# EAGLE design ssl (EAGLE 6.5.0)
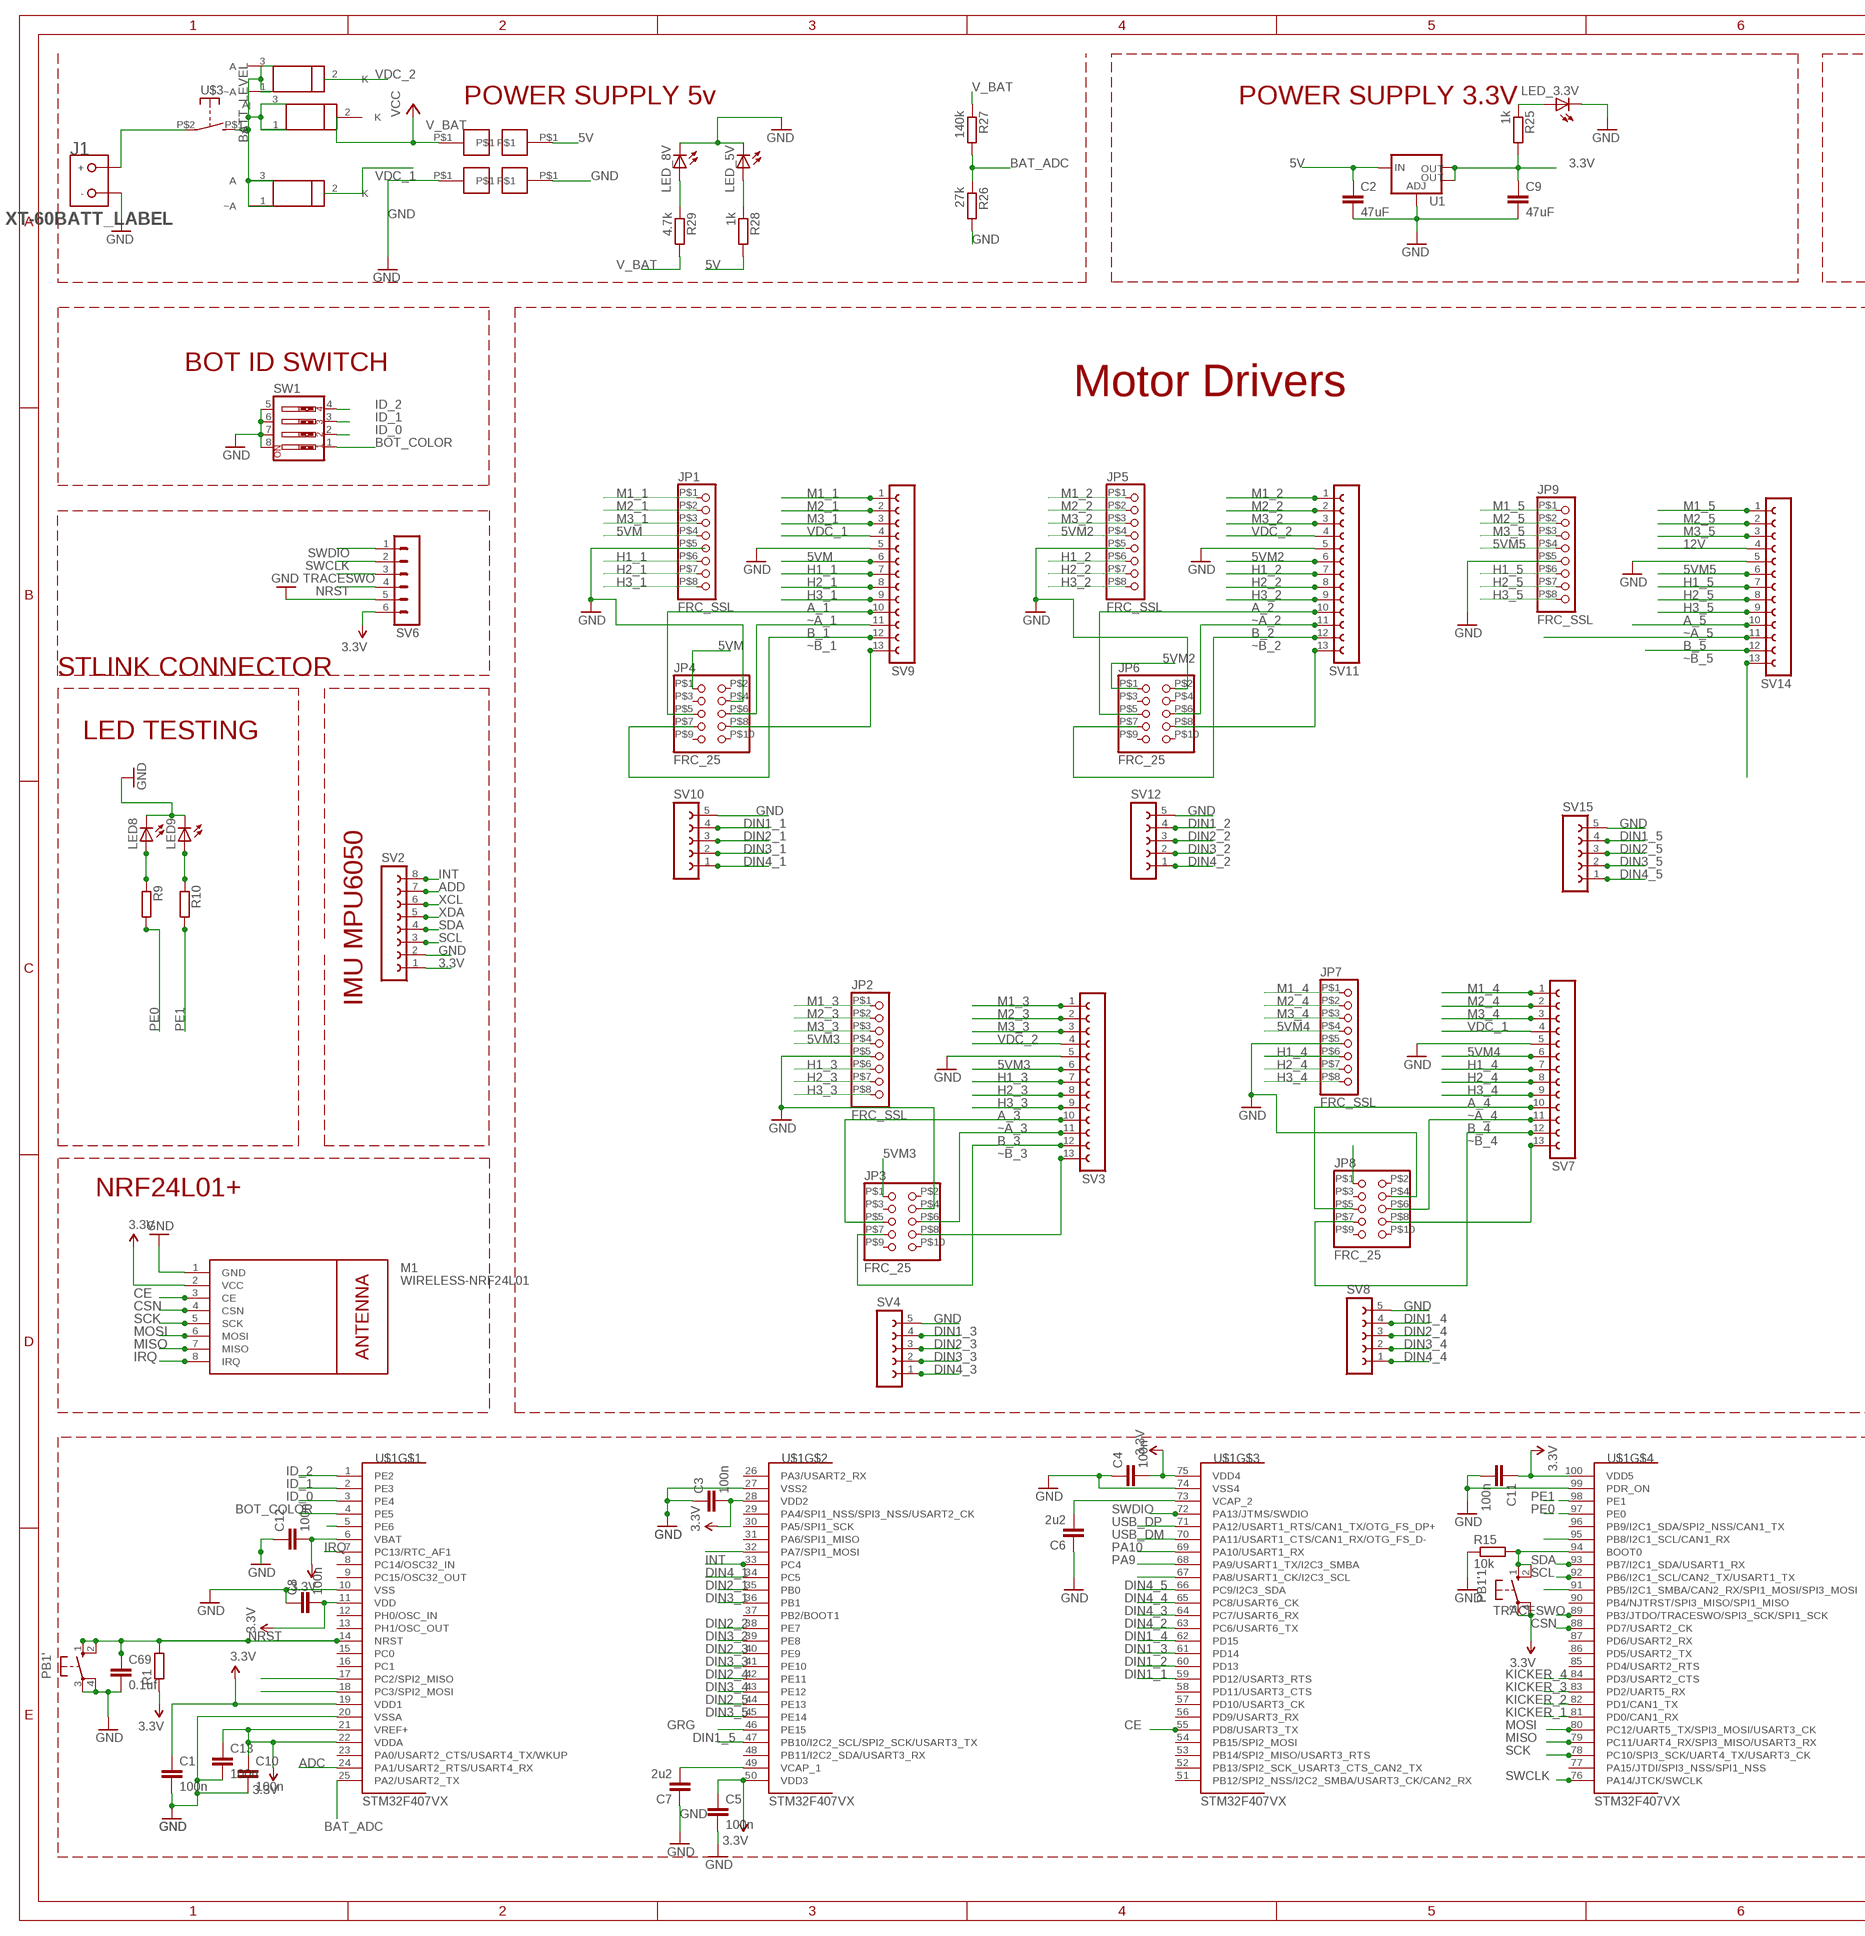
[diagram p0: schematic, sheet 1, part 1 of 2]
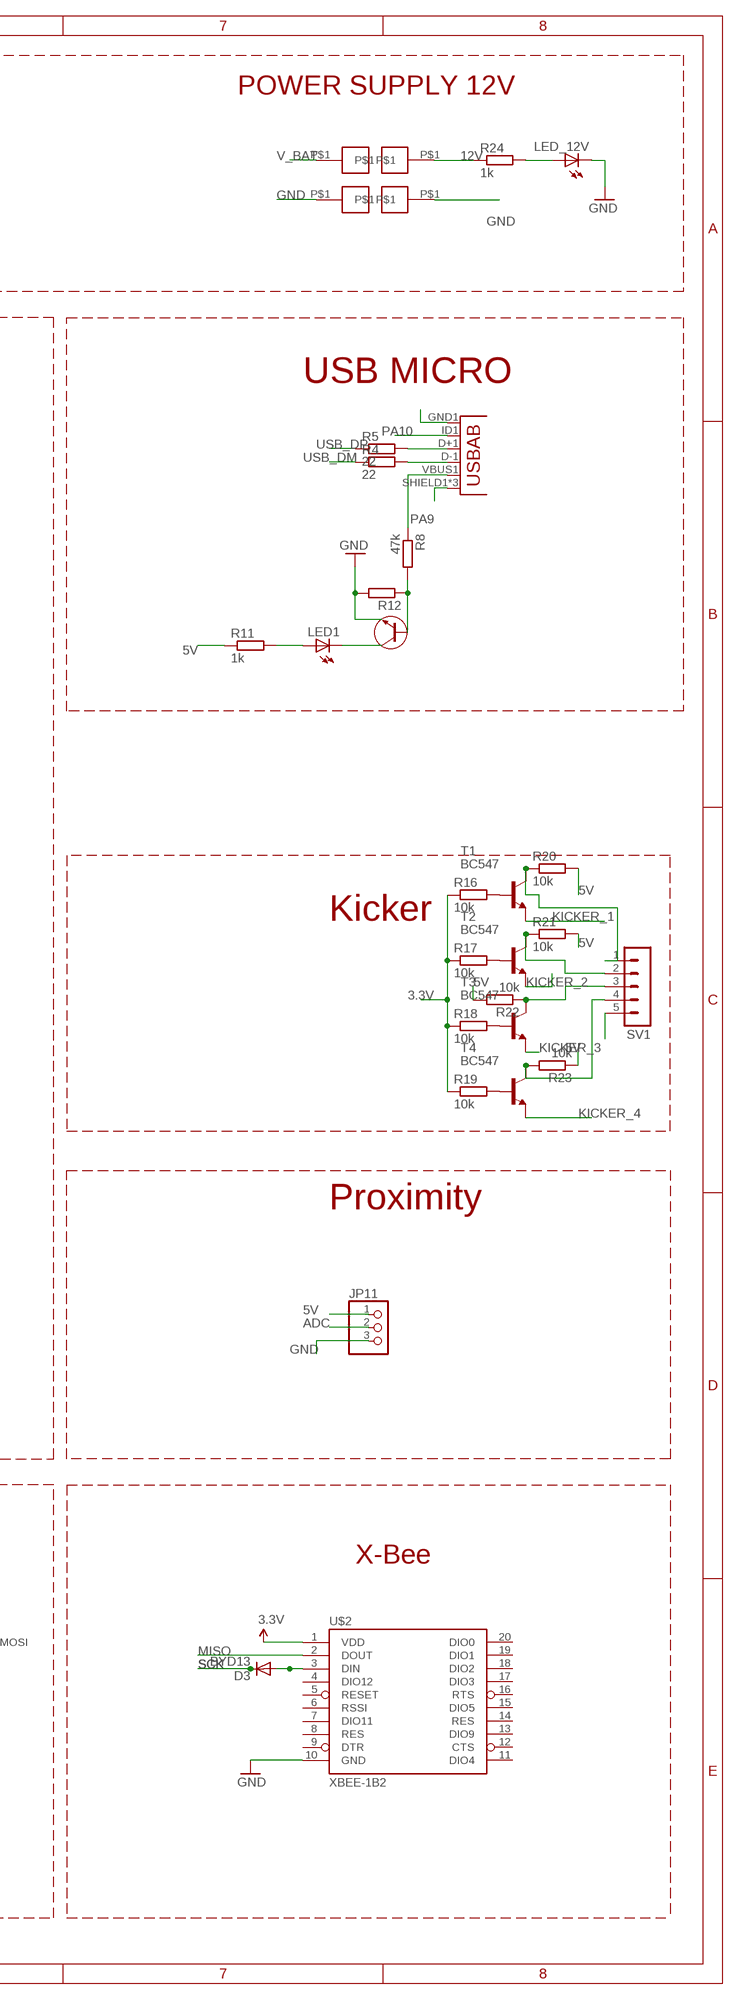
[diagram p1: schematic, sheet 1, part 2 of 2]

## Parts
5V  PINHEAD_1  [PINHEAD_1]
12V  PINHEAD_1  [PINHEAD_1]
C1  100n  C-EUC1206  [C1206]
C2  47uF  C-EUC1206  [C1206]
C3  100n  C-EUC1206  [C1206]
C4  100n  C-EUC1206  [C1206]
C5  100n  C-EUC1206  [C1206]
C6  2u2  C-EUC1206  [C1206]
C7  2u2  C-EUC1206  [C1206]
C8  100n  C-EUC1206  [C1206]
C9  47uF  C-EUC1206  [C1206]
C10  100n  C-EUC1206  [C1206]
C11  100n  C-EUC1206  [C1206]
C12  100n  C-EUC1206  [C1206]
C13  100n  C-EUC1206  [C1206]
C69  0.1uf  C-EUC1206  [C1206]
D3  BYD13  [SOD81]
GND  PINHEAD_1  [PINHEAD_1]
GND2  PINHEAD_1  [PINHEAD_1]
GND_5V  PINHEAD_1  [PINHEAD_1]
GND_12V  PINHEAD_1  [PINHEAD_1]
J1  XT-60BATT_LABEL  [XT-60]
JP1  FRC_SSL  [FRC]
JP2  FRC_SSL  [FRC]
JP3  FRC_25  [FRC2*5]
JP4  FRC_25  [FRC2*5]
JP5  FRC_SSL  [FRC]
JP6  FRC_25  [FRC2*5]
JP7  FRC_SSL  [FRC]
JP8  FRC_25  [FRC2*5]
JP9  FRC_SSL  [FRC]
JP11  PINHD-1X3  [1X03]
LED1  LEDCHIPLED_1206  [CHIPLED_1206]
LED8  LEDCHIPLED_1206  [CHIPLED_1206]
LED9  LEDCHIPLED_1206  [CHIPLED_1206]
LED_3.3V  LEDCHIPLED_1206  [CHIPLED_1206]
LED_5V  LEDCHIPLED_1206  [CHIPLED_1206]
LED_8V  LEDCHIPLED_1206  [CHIPLED_1206]
LED_12V  LEDCHIPLED_1206  [CHIPLED_1206]
M1  WIRELESS-NRF24L01  [WIRELESS-NRF24L01]
PB1'  10-XX  [B3F-10XX]
PB1'1  10-XX  [B3F-10XX]
Q1  TRANSISTOR-NPN-TO-92-EBC  [TO-92]
R1  R-EU_M0805  [M0805]
R4  22  R-EU_R1206  [R1206]
R5  22  R-EU_R1206  [R1206]
R8  47k  R-EU_R1206  [R1206]
R9  R-EU_R1206  [R1206]
R10  R-EU_R1206  [R1206]
R11  1k  R-EU_R1206  [R1206]
R12  R-EU_R1206  [R1206]
R15  10k  R-EU_R1206  [R1206]
R16  10k  R-EU_R1206  [R1206]
R17  10k  R-EU_R1206  [R1206]
R18  10k  R-EU_R1206  [R1206]
R19  10k  R-EU_R1206  [R1206]
R20  10k  R-EU_R1206  [R1206]
R21  10k  R-EU_R1206  [R1206]
R22  10k  R-EU_R1206  [R1206]
R23  10k  R-EU_R1206  [R1206]
R24  1k  R-EU_R1206  [R1206]
R25  1k  R-EU_R1206  [R1206]
R26  27k  R-EU_R1206  [R1206]
R27  140k  R-EU_R1206  [R1206]
R28  1k  R-EU_R1206  [R1206]
R29  4.7k  R-EU_R1206  [R1206]
SV1  MA05-1  [MA05-1]
SV2  FE08-1  [FE08]
SV3  FE13-1  [FE13]
SV4  FE05-1  [FE05-1]
SV6  MA06-1  [MA06-1]
SV7  FE13-1  [FE13]
SV8  FE05-1  [FE05-1]
SV9  FE13-1  [FE13]
SV10  FE05-1  [FE05-1]
SV11  FE13-1  [FE13]
SV12  FE05-1  [FE05-1]
SV14  FE13-1  [FE13]
SV15  FE05-1  [FE05-1]
SW1  SW_DIP-4  [EDG-04]
T1  BC547  [TO92]
T2  BC547  [TO92]
T3  BC547  [TO92]
T4  BC547  [TO92]
U1  V_REG_LM1117SOT223  [SOT223]
U2  LP38690DT-3.3  [TO228P1042X238-3N]
U3  LP38690DT-3.3  [TO228P1042X238-3N]
U4  LP38690DT-3.3  [TO228P1042X238-3N]
U5  USB-ABCONN-11794  [USB-AB-MICRO-SMD_V03]
U$1  STM32F407VX  [LQFP100]
U$2  XBEE-1B2  [XBEE-SILK]
U$3  SWITCH_DA10  [DA10]
V_BAT  PINHEAD_1  [PINHEAD_1]
V_BAT_12V  PINHEAD_1  [PINHEAD_1]

## Nets
3.3V: C1.1 C3.2 C4.2 C5.1 C8.2 C9.1 C10.1 C11.1 C12.2 C13.1 M1.2(VCC) PB1'1.3(P) PB1'1.4(P1) Q1.1(E) R1.1 R12.2 R16.1 R17.1 R18.1 R19.1 R25.2 SV2.1 SV6.6 U1.2(OUT) U1.4(OUT) U$1.6(VBAT) U$1.11(VDD) U$1.19(VDD1) U$1.21(VREF+) U$1.22(VDDA) U$1.28(VDD2) U$1.50(VDD3) U$1.75(VDD4) U$1.100(VDD5) U$2.1(VDD) ; supply symbol labelled GND
5V: 5V.P$1 C2.1 JP11.1 R11.1 R20.2 R21.2 R22.2 R23.1 R28.2 U1.3(IN)
5VM: JP1.P$4 JP4.P$1 SV9.6
5VM2: JP5.P$4 JP6.P$1 SV11.6
5VM3: JP2.P$4 JP3.P$1 SV3.6
5VM4: JP7.P$4 JP8.P$1 SV7.6
5VM5: JP9.P$4 SV14.6
12V: 12V.P$1 R24.1 SV14.4
A_1: JP4.P$5 SV9.10
A_2: JP6.P$5 SV11.10
A_3: JP3.P$5 SV3.10
A_4: JP8.P$5 SV7.10
A_5: SV14.10
ADC: JP11.2 U$1.24(PA1/USART2_RTS/USART4_RX)
ADD: SV2.7
B_1: JP4.P$7 SV9.12
B_2: JP6.P$7 SV11.12
B_3: JP3.P$7 SV3.12
B_4: JP8.P$7 SV7.12
B_5: SV14.12
BAT_ADC: R26.1 R27.2 U$1.25(PA2/USART2_TX)
BATT_LEVEL: U2.1(~A) U2.3(A) U3.1(~A) U3.3(A) U4.1(~A) U4.3(A) U$3.P$1(S)
BATTERY: J1.BATT(+) U$3.P$2(P)
BOT_COLOR: SW1.1 U$1.4(PE5)
CE: M1.3(CE) U$1.55(PD8/USART3_TX)
CSN: M1.4(CSN) U$1.88(PD7/USART2_CK)
DIN1_1: SV10.4 U$1.59(PD12/USART3_RTS)
DIN1_2: SV12.4 U$1.60(PD13)
DIN1_3: SV4.4 U$1.61(PD14)
DIN1_4: SV8.4 U$1.62(PD15)
DIN1_5: SV15.4 U$1.47(PB10/I2C2_SCL/SPI2_SCK/USART3_TX)
DIN2_1: SV10.3 U$1.35(PB0)
DIN2_2: SV12.3 U$1.38(PE7)
DIN2_3: SV4.3 U$1.40(PE9)
DIN2_4: SV8.3 U$1.42(PE11)
DIN2_5: SV15.3 U$1.44(PE13)
DIN3_1: SV10.2 U$1.36(PB1)
DIN3_2: SV12.2 U$1.39(PE8)
DIN3_3: SV4.2 U$1.41(PE10)
DIN3_4: SV8.2 U$1.43(PE12)
DIN3_5: SV15.2 U$1.45(PE14)
DIN4_1: SV10.1 U$1.34(PC5)
DIN4_2: SV12.1 U$1.63(PC6/USART6_TX)
DIN4_3: SV4.1 U$1.64(PC7/USART6_RX)
DIN4_4: SV8.1 U$1.65(PC8/USART6_CK)
DIN4_5: SV15.1 U$1.66(PC9/I2C3_SDA)
GND: C1.2 C2.2 C3.1 C4.1 C5.2 C6.1 C7.1 C8.1 C9.2 C10.2 C11.2 C12.1 C13.2 C69.2 GND2.P$1 GND.P$1 GND_5V.P$1 GND_12V.P$1 J1.GND(-) JP3.P$4 JP4.P$4 JP6.P$2 JP8.P$4 JP11.3 LED8.C LED9.C LED_3.3V.C LED_5V.C LED_8V.C LED_12V.C M1.1(GND) PB1'.3(P) PB1'.4(P1) R15.1 R26.2 SV1.5 SV2.2 SV3.5 SV4.5 SV6.5 SV7.5 SV8.5 SV9.5 SV10.5 SV11.5 SV12.5 SV14.5 SV15.5 SW1.5 SW1.6 SW1.7 SW1.8 U1.1(ADJ) U5.GND1(GND) U5.SHIELD1(SHIELD) U5.SHIELD2(SHIELD) U5.SHIELD3(SHIELD) U$1.10(VSS) U$1.20(VSSA) U$1.27(VSS2) U$1.74(VSS4) U$1.99(PDR_ON) U$2.10(GND)
GRG: U$1.46(PE15)
H1_1: JP1.P$6 SV9.7
H1_2: JP5.P$6 SV11.7
H1_3: JP2.P$6 SV3.7
H1_4: JP7.P$6 SV7.7
H1_5: JP9.P$6 SV14.7
H2_1: JP1.P$7 SV9.8
H2_2: JP5.P$7 SV11.8
H2_3: JP2.P$7 SV3.8
H2_4: JP7.P$7 SV7.8
H2_5: JP9.P$7 SV14.8
H3_1: JP1.P$8 SV9.9
H3_2: JP5.P$8 SV11.9
H3_3: JP2.P$8 SV3.9
H3_4: JP7.P$8 SV7.9
H3_5: JP9.P$8 SV14.9
ID_0: SW1.2 U$1.3(PE4)
ID_1: SW1.3 U$1.2(PE3)
ID_2: SW1.4 U$1.1(PE2)
INT: SV2.8 U$1.33(PC4)
IRQ: M1.8(IRQ) U$1.7(PC13/RTC_AF1)
KICKER_1: T1.1(E) U$1.81(PD0/CAN1_RX)
KICKER_2: T2.1(E) U$1.82(PD1/CAN1_TX)
KICKER_3: T3.1(E) U$1.83(PD2/UART5_RX)
KICKER_4: T4.1(E) U$1.84(PD3/USART2_CTS)
M1_1: JP1.P$1 SV9.1
M1_2: JP5.P$1 SV11.1
M1_3: JP2.P$1 SV3.1
M1_4: JP7.P$1 SV7.1
M1_5: JP9.P$1 SV14.1
M2_1: JP1.P$2 SV9.2
M2_2: JP5.P$2 SV11.2
M2_3: JP2.P$2 SV3.2
M2_4: JP7.P$2 SV7.2
M2_5: JP9.P$2 SV14.2
M3_1: JP1.P$3 SV9.3
M3_2: JP5.P$3 SV11.3
M3_3: JP2.P$3 SV3.3
M3_4: JP7.P$3 SV7.3
M3_5: JP9.P$3 SV14.3
MISO: M1.7(MISO) U$1.79(PC11/UART4_RX/SPI3_MISO/USART3_RX) U$2.2(DOUT)
MOSI: M1.6(MOSI) U$1.80(PC12/UART5_TX/SPI3_MOSI/USART3_CK)
N$1: R5.2 U5.D+1(D+)
N$2: LED9.A R10.1
N$3: C7.2 U$1.49(VCAP_1)
N$4: C6.2 U$1.73(VCAP_2)
N$5: R4.2 U5.D-1(D-)
N$6: PB1'1.1(S) PB1'1.2(S1) R15.2 U$1.94(BOOT0)
N$7: U$1.5(PE6)
N$8: U$1.32(PA7/SPI1_MOSI)
N$9: LED8.A R9.1
N$10: Q1.2(B) R8.2 R12.1
N$11: LED1.C Q1.3(C)
N$12: D3.A U$2.3(DIN)
N$13: LED1.A R11.2
N$14: LED_12V.A R24.2
N$15: LED_8V.A R29.1
N$16: U$1.17(PC2/SPI2_MISO)
N$17: U$1.18(PC3/SPI2_MOSI)
N$18: LED_5V.A R28.1
N$19: LED_3.3V.A R25.1
N$20: U$1.95(PB8/I2C1_SCL/CAN1_RX)
N$21: R18.2 T3.2(B)
N$22: U$1.91(PB5/I2C1_SMBA/CAN2_RX/SPI1_MOSI/SPI3_MOSI)
N$23: R16.2 T1.2(B)
N$24: U$1.67(PA8/USART1_CK/I2C3_SCL)
N$25: R17.2 T2.2(B)
N$26: R19.2 T4.2(B)
N$31: R20.1 SV1.1 T1.3(C)
N$32: R21.1 SV1.2 T2.3(C)
N$33: R22.1 SV1.3 T3.3(C)
N$34: R23.2 SV1.4 T4.3(C)
NRST: C69.1 PB1'.1(S) PB1'.2(S1) R1.2 SV6.4 U$1.14(NRST)
PA9: R8.1 U5.VBUS1(VBUS) U$1.68(PA9/USART1_TX/I2C3_SMBA)
PA10: U5.ID1(USBID) U$1.69(PA10/USART1_RX)
PE0: R9.2 U$1.97(PE0)
PE1: R10.2 U$1.98(PE1)
SCK: D3.C M1.5(SCK) U$1.78(PC10/SPI3_SCK/UART4_TX/USART3_CK)
SCL: SV2.3 U$1.92(PB6/I2C1_SCL/CAN2_TX/USART1_TX)
SDA: SV2.4 U$1.93(PB7/I2C1_SDA/USART1_RX)
SWCLK: SV6.2 U$1.76(PA14/JTCK/SWCLK)
SWDIO: SV6.1 U$1.72(PA13/JTMS/SWDIO)
TRACESWO: SV6.3 U$1.89(PB3/JTDO/TRACESWO/SPI3_SCK/SPI1_SCK)
USB_DM: R4.1 U$1.70(PA11/USART1_CTS/CAN1_RX/OTG_FS_D-)
USB_DP: R5.1 U$1.71(PA12/USART1_RTS/CAN1_TX/OTG_FS_DP+)
V_BAT: R27.1 R29.2 U2.2(K) V_BAT.P$1 V_BAT_12V.P$1 ; supply symbol labelled VCC
VDC_1: SV7.4 SV9.4 U4.2(K)
VDC_2: SV3.4 SV11.4 U3.2(K)
XCL: SV2.6
XDA: SV2.5
~A_1: JP4.P$6 SV9.11
~A_2: JP6.P$6 SV11.11
~A_3: JP3.P$6 SV3.11
~A_4: JP8.P$6 SV7.11
~A_5: SV14.11
~B_1: JP4.P$8 SV9.13
~B_2: JP6.P$8 SV11.13
~B_3: JP3.P$8 SV3.13
~B_4: JP8.P$8 SV7.13
~B_5: SV14.13
Unconnected: JP1.P$5 JP2.P$5 JP3.P$2 JP3.P$3 JP3.P$9 JP3.P$10 JP4.P$2 JP4.P$3 JP4.P$9 JP4.P$10 JP5.P$5 JP6.P$3 JP6.P$4 JP6.P$9 JP6.P$10 JP7.P$5 JP8.P$2 JP8.P$3 JP8.P$9 JP8.P$10 JP9.P$5 U$1.8(PC14/OSC32_IN) U$1.9(PC15/OSC32_OUT) U$1.12(PH0/OSC_IN) U$1.13(PH1/OSC_OUT) U$1.15(PC0) U$1.16(PC1) U$1.23(PA0/USART2_CTS/USART4_TX/WKUP) U$1.26(PA3/USART2_RX) U$1.29(PA4/SPI1_NSS/SPI3_NSS/USART2_CK) U$1.30(PA5/SPI1_SCK) U$1.31(PA6/SPI1_MISO) U$1.37(PB2/BOOT1) U$1.48(PB11/I2C2_SDA/USART3_RX) U$1.51(PB12/SPI2_NSS/I2C2_SMBA/USART3_CK/CAN2_RX) U$1.52(PB13/SPI2_SCK_USART3_CTS_CAN2_TX) U$1.53(PB14/SPI2_MISO/USART3_RTS) U$1.54(PB15/SPI2_MOSI) U$1.56(PD9/USART3_RX) U$1.57(PD10/USART3_CK) U$1.58(PD11/USART3_CTS) U$1.77(PA15/JTDI/SPI3_NSS/SPI1_NSS) U$1.85(PD4/USART2_RTS) U$1.86(PD5/USART2_TX) U$1.87(PD6/USART2_RX) U$1.90(PB4/NJTRST/SPI3_MISO/SPI1_MISO) U$1.96(PB9/I2C1_SDA/SPI2_NSS/CAN1_TX) U$2.4(DIO12) U$2.5(RESET) U$2.6(RSSI) U$2.7(DIO11) U$2.8(RES) U$2.9(DTR) U$2.11(DIO4) U$2.12(CTS) U$2.13(DIO9) U$2.14(RES) U$2.15(DIO5) U$2.16(RTS) U$2.17(DIO3) U$2.18(DIO2) U$2.19(DIO1) U$2.20(DIO0)

## Notes on the sheet
- POWER SUPPLY 12V
- POWER SUPPLY 5v | POWER SUPPLY 3.3V
- BOT ID SWITCH | USB MICRO
- Motor Drivers
- STLINK CONNECTOR
- LED TESTING
- Kicker
- IMU MPU6050
- Proximity
- NRF24L01+
- X-Bee

## Library data of the parts
5V 12V GND GND2 GND_5V GND_12V V_BAT V_BAT_12V = pinhead_1:PINHEAD_1
C1-C13 C69 = rcl:C-EU: CAPACITOR, European symbol
D3 = diode:BYD13: DIODE controlled avalanche rectifier
J1 = RoboJackets-Connectors:XT-60: XT-60 Power Connector Distributor: HobbyKing <http://www.hobbyking.com/hobbyking/store/RC_PRODUCT_SEARCH.asp?strSearch=xt-60>
JP1 JP2 JP5 JP7 JP9 = frc:FRC_SSL
JP3 JP4 JP6 JP8 = mohit:FRC_2*5
JP11 = adafruit:PINHD-1X3: PIN HEADER
LED1 LED8 LED9 LED_3.3V LED_5V LED_8V LED_12V = led:LED: LED OSRAM: - CHIPLED LG R971, LG N971, LY N971, LG Q971, LY Q971, LO R971, LY R971 LH N974, LH R974 LS Q976, LO Q976, LY Q976 LO Q996 - Hyper CHIPLED LW Q18S LB Q993, LB Q99A, LB R99A - SideLED LS A670, LO A670, LY A670, LG A670, LP A670 LB A673, LV A673, LT A673, LW A673 LH A674 LY A675 LS A676, LA A676, LO A676, LY A676, LW A676 LS A679, LY A679, LG A679 - Hyper Micro SIDELED® LS Y876, LA Y876, LO Y876, LY Y876 LT Y87S - SmartLED LW L88C, LW L88S LB L89C, LB L89S, LG L890 LS L89K, LO L89K, LY L89K LS L896, LA L896, LO L896, LY L896 - TOPLED LS T670, LO T670, LY T670, LG T670, LP T670 LSG T670, LSP T670, LSY T670, LOP T670, LYG T670 LG T671, LOG T671, LSG T671 LB T673, LV T673, LT T673, LW T673 LH T674 LS T676, LA T676, LO T676, LY T676, LB T676, LH T676, LSB T676, LW T676 LB T67C, LV T67C, LT T67C, LS T67K, LO T67K, LY T67K, LW E67C LS E67B, LA E67B, LO E67B, LY E67B, LB E67C, LV E67C, LT E67C LW T67C LS T679, LY T679, LG T679 LS T770, LO T770, LY T770, LG T770, LP T770 LB T773, LV T773, LT T773, LW T773 LH T774 LS E675, LA E675, LY E675, LS T675 LS T776, LA T776, LO T776, LY T776, LB T776 LHGB T686 LT T68C, LB T68C - Hyper Mini TOPLED® LB M676 - Mini TOPLED Santana® LG M470 LS M47K, LO M47K, LY M47K Source: http://www.osram.convergy.de LUXEON: - LUMILED® LXK2-PW12-R00, LXK2-PW12-S00, LXK2-PW14-U00, LXK2-PW14-V00 LXK2-PM12-R00, LXK2-PM12-S00, LXK2-PM14-U00 LXK2-PE12-Q00, LXK2-PE12-R00, LXK2-PE12-S00, LXK2-PE14-T00, LXK2-PE14-U00 LXK2-PB12-K00, LXK2-PB12-L00, LXK2-PB12-M00, LXK2-PB14-N00, LXK2-PB14-P00, LXK2-PB14-Q00 LXK2-PR12-L00, LXK2-PR12-M00, LXK2-PR14-Q00, LXK2-PR14-R00 LXK2-PD12-Q00, LXK2-PD12-R00, LXK2-PD12-S00 LXK2-PH12-R00, LXK2-PH12-S00 LXK2-PL12-P00, LXK2-PL12-Q00, LXK2-PL12-R00 Source: www.luxeon.com KINGBRIGHT: KA-3528ASYC Source: www.kingbright.com
M1 = diy-modules:WIRELESS-NRF24L01: 2.4 GHz Wireless Module based on NRF24L01 chip
PB1' PB1'1 = switch-omron:10-XX: OMRON SWITCH; MPN: B3F-1000; OC_FARNELL: 176432; OC_NEWARK: 36M3542
Q1 = TRANSISTOR-NPN:TRANSISTOR-NPN
R1 R4 R5 R8-R12 R15-R29 = resistor:R-EU_: RESISTOR, European symbol
SV1 = con-lstb:MA05-1: PIN HEADER; OC_FARNELL: unknown; OC_NEWARK: unknown
SV2 = con-lsta:FE08-1: FEMALE HEADER; OC_FARNELL: unknown; OC_NEWARK: unknown
SV3 SV7 SV9 SV11 SV14 = con-lsta:FE13-1: FEMALE HEADER; OC_FARNELL: unknown; OC_NEWARK: unknown
SV4 SV8 SV10 SV12 SV15 = con-lsta:FE05-1: FEMALE HEADER; OC_FARNELL: unknown; OC_NEWARK: unknown
SV6 = con-lstb:MA06-1: PIN HEADER; OC_FARNELL: unknown; OC_NEWARK: unknown
SW1 = special:SW_DIP-4: DIP SWITCH
T1-T4 = transistor:BC547: NPN TRANSISTOR
U1 = SparkFun-PowerIC:V_REG_LM1117: Voltage Regulator LM1117 Standard adjustable voltage regulator but in SMD form. Spark Fun Electronics SKU : COM-00595; PROD_ID: VREG-08170
U2-U4 = LP38690DT-3.3:LP38690DT-3.3; MPN: LP38690DT-3.3; OC_FARNELL: 1008048; OC_NEWARK: 41K7439; PACKAGE: TO-252; SUPPLIER: National Semiconductor
U5 = SparkFun-Connectors:USB-AB: This is a USB AB connector that is compatible with USB OTG. i.e. this connector can serve as a host or device; PROD_ID: CONN-11794
U$1 = STM32F407Vx_LQFP100:STM32F407VX: STmicroelectronics Cortex M4 Series Typ: STM32F407Vx LQFP100 Copyright 2012 by Ersan Günes, Quantitec, info@quantitec.de
U$2 = SparkFun:XBEE-1
U$3 = switch_DA10:SWITCH_DA10

## Board
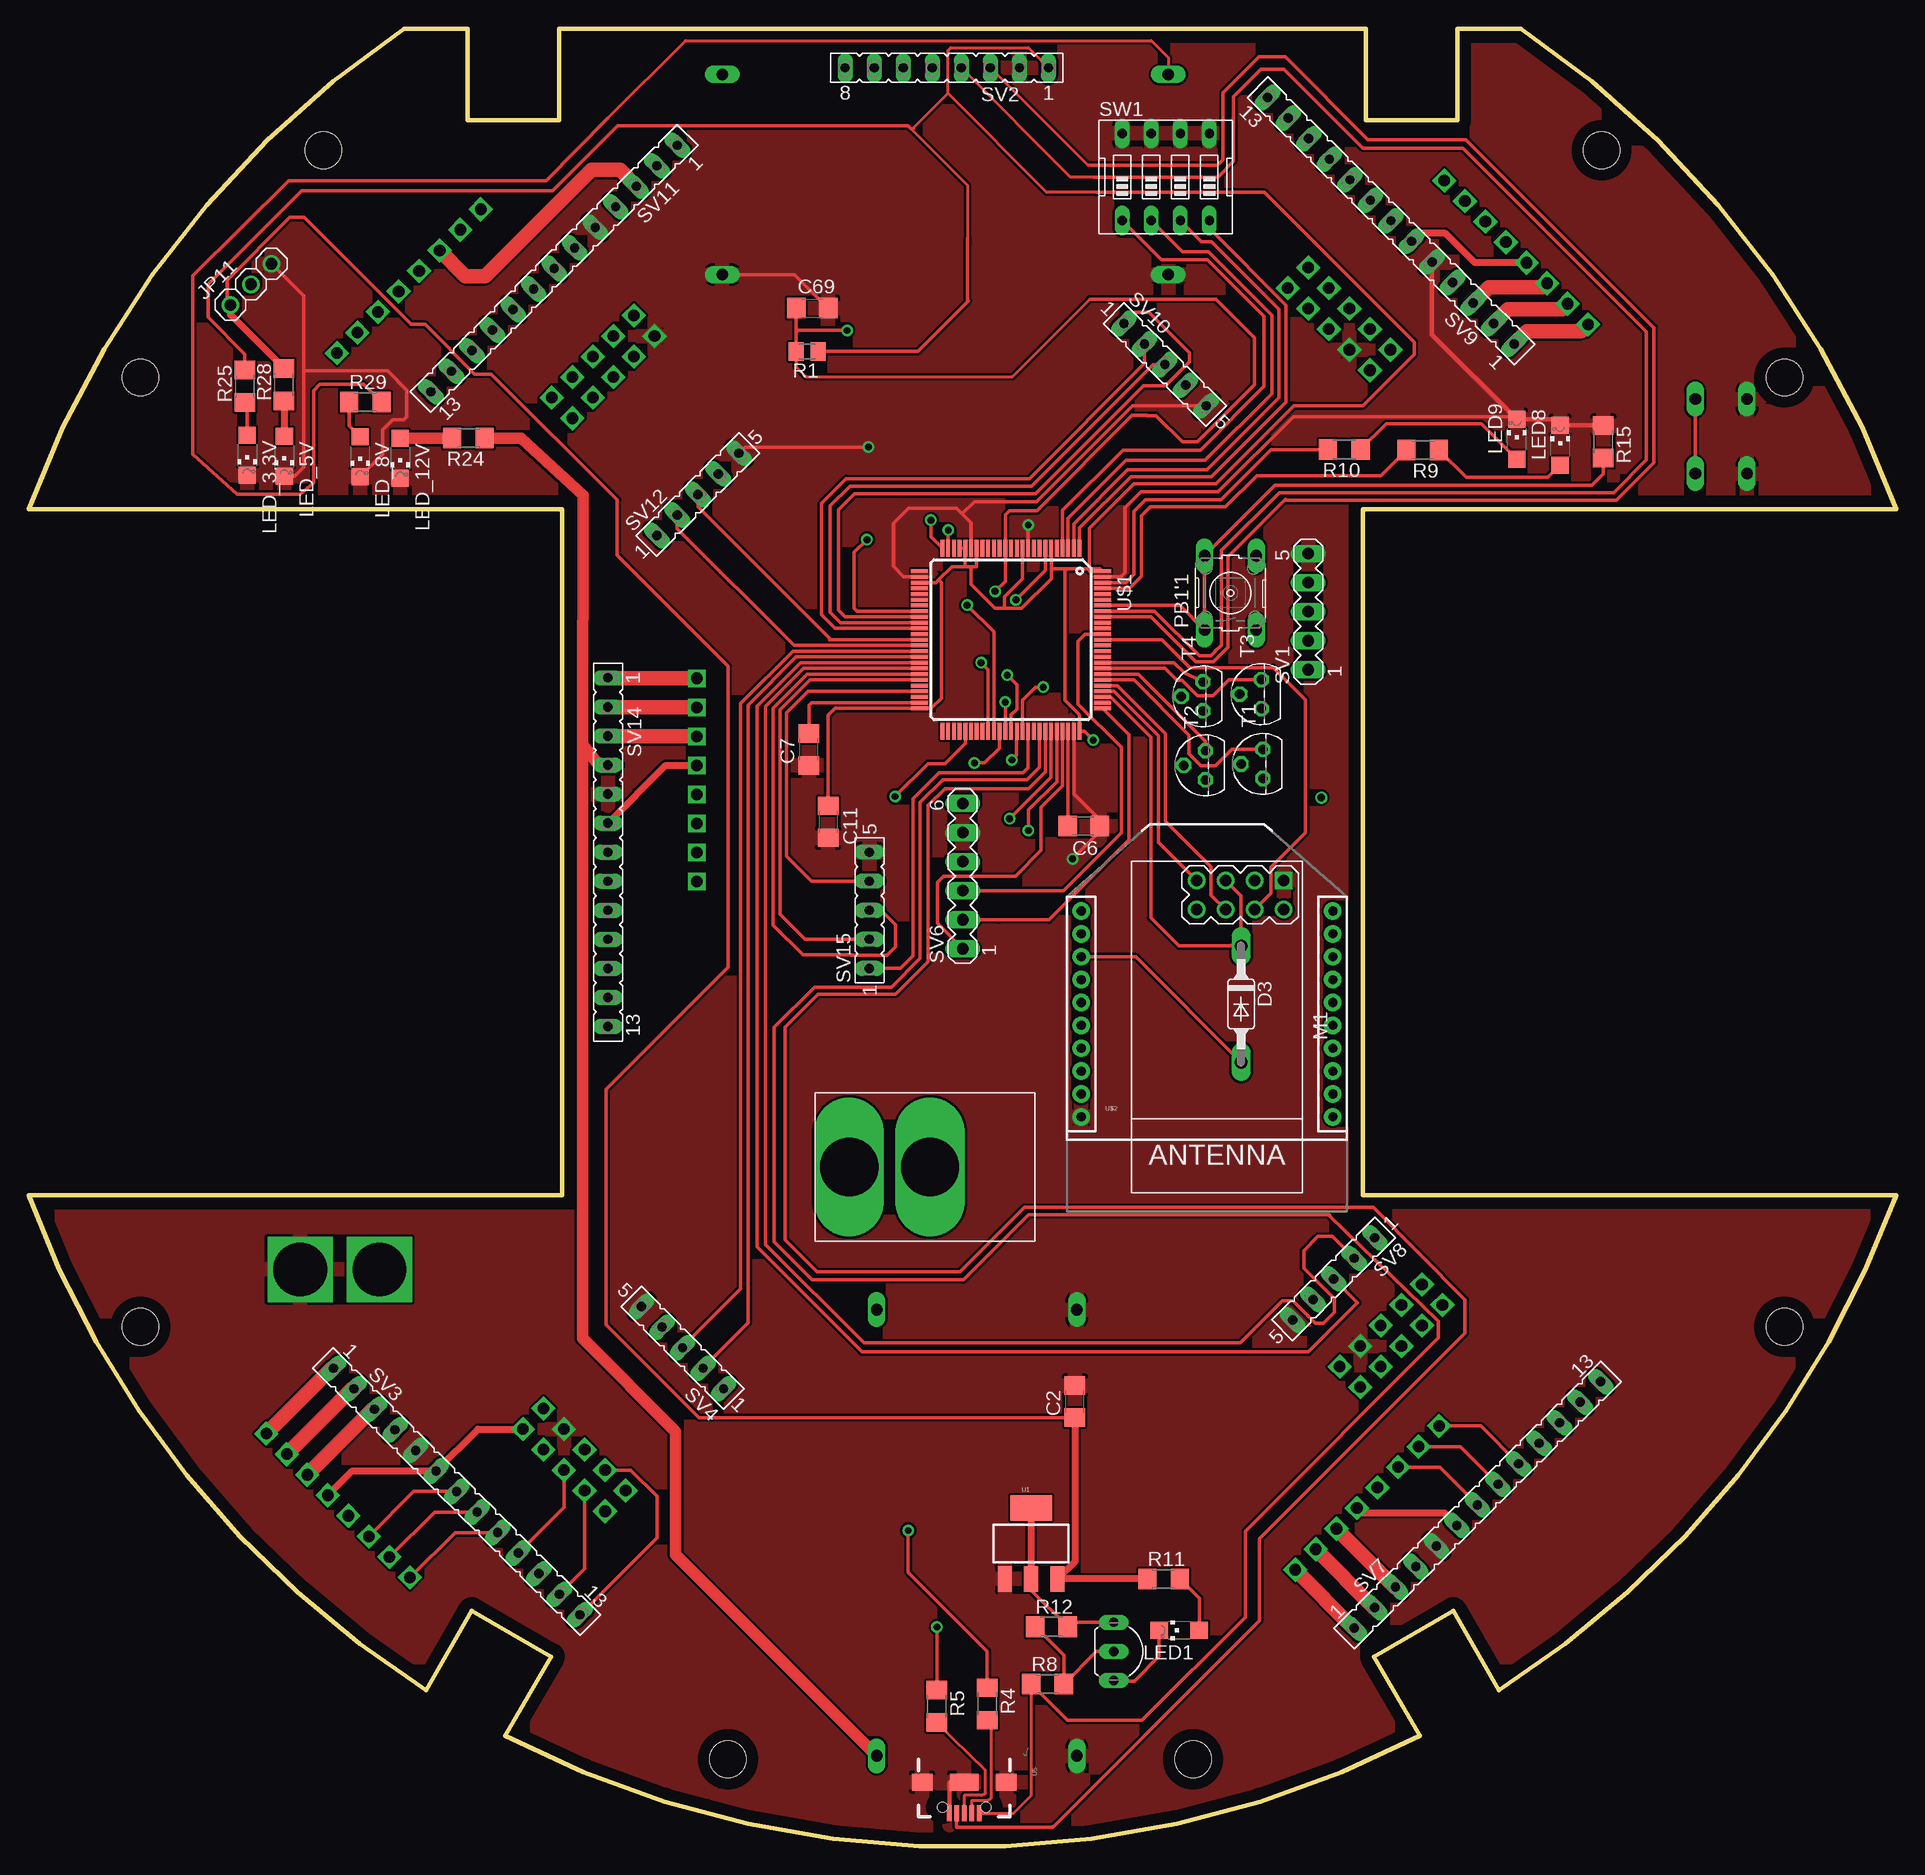
[diagram p2: board, top side]
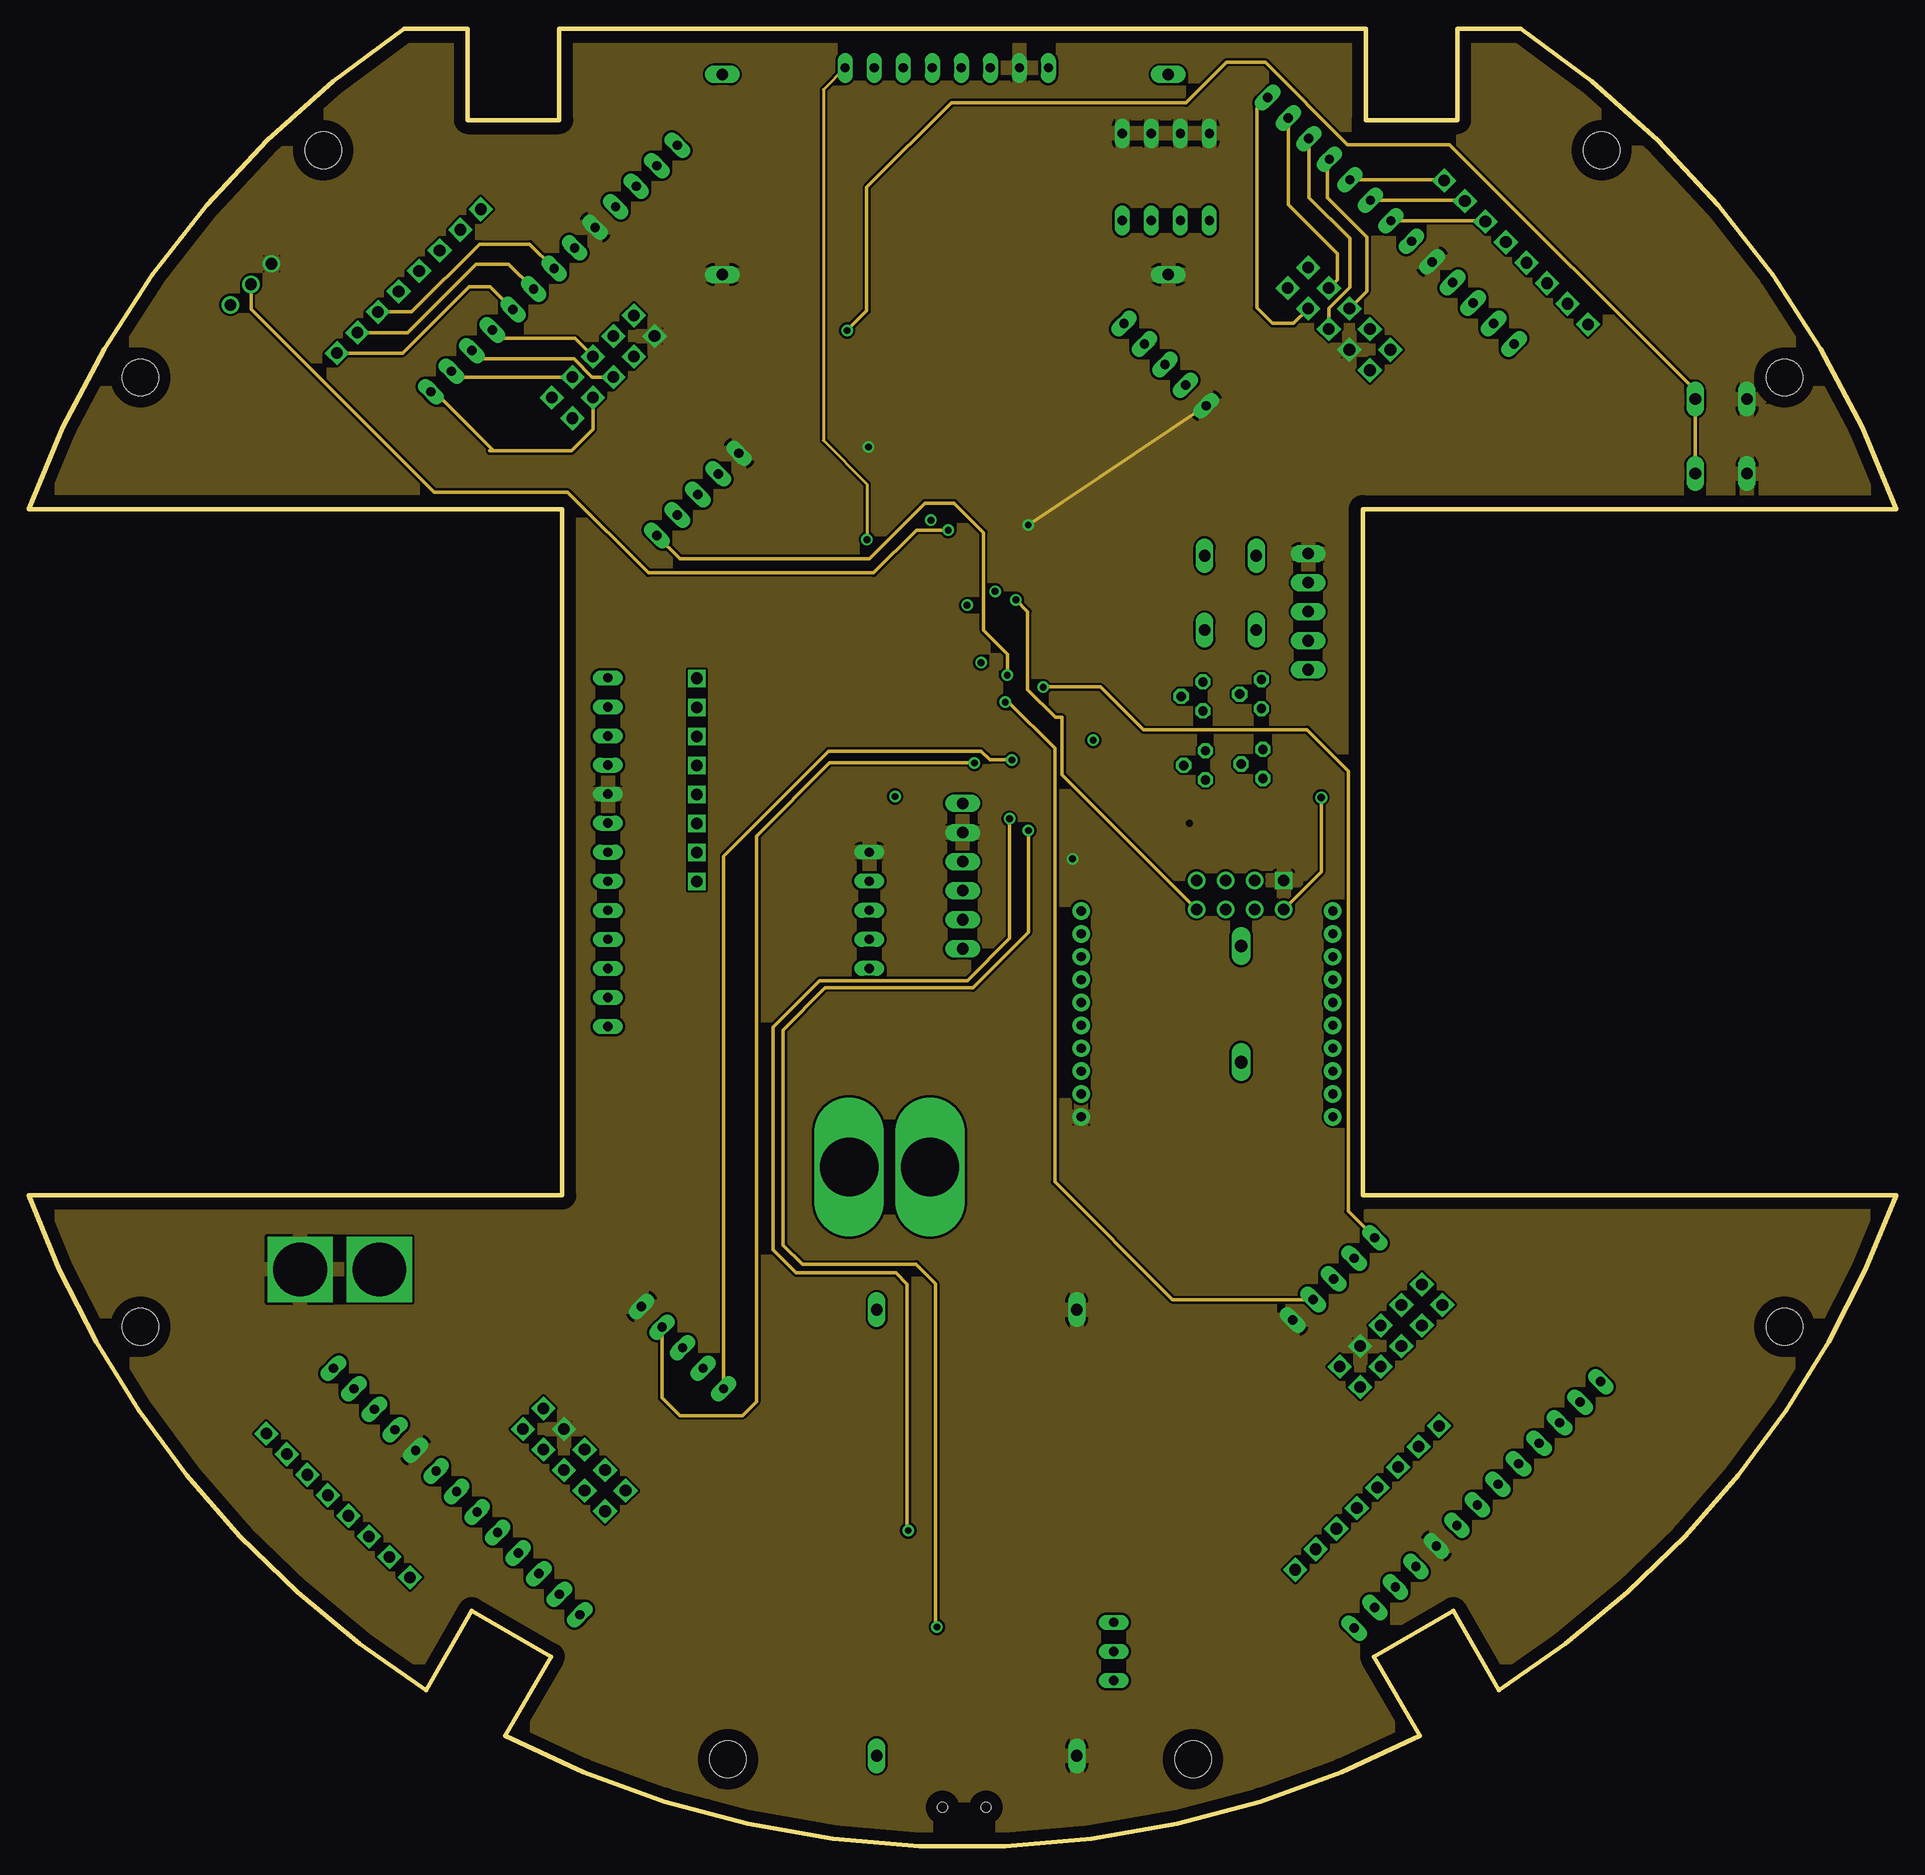
[diagram p3: board, inner layer Route2]
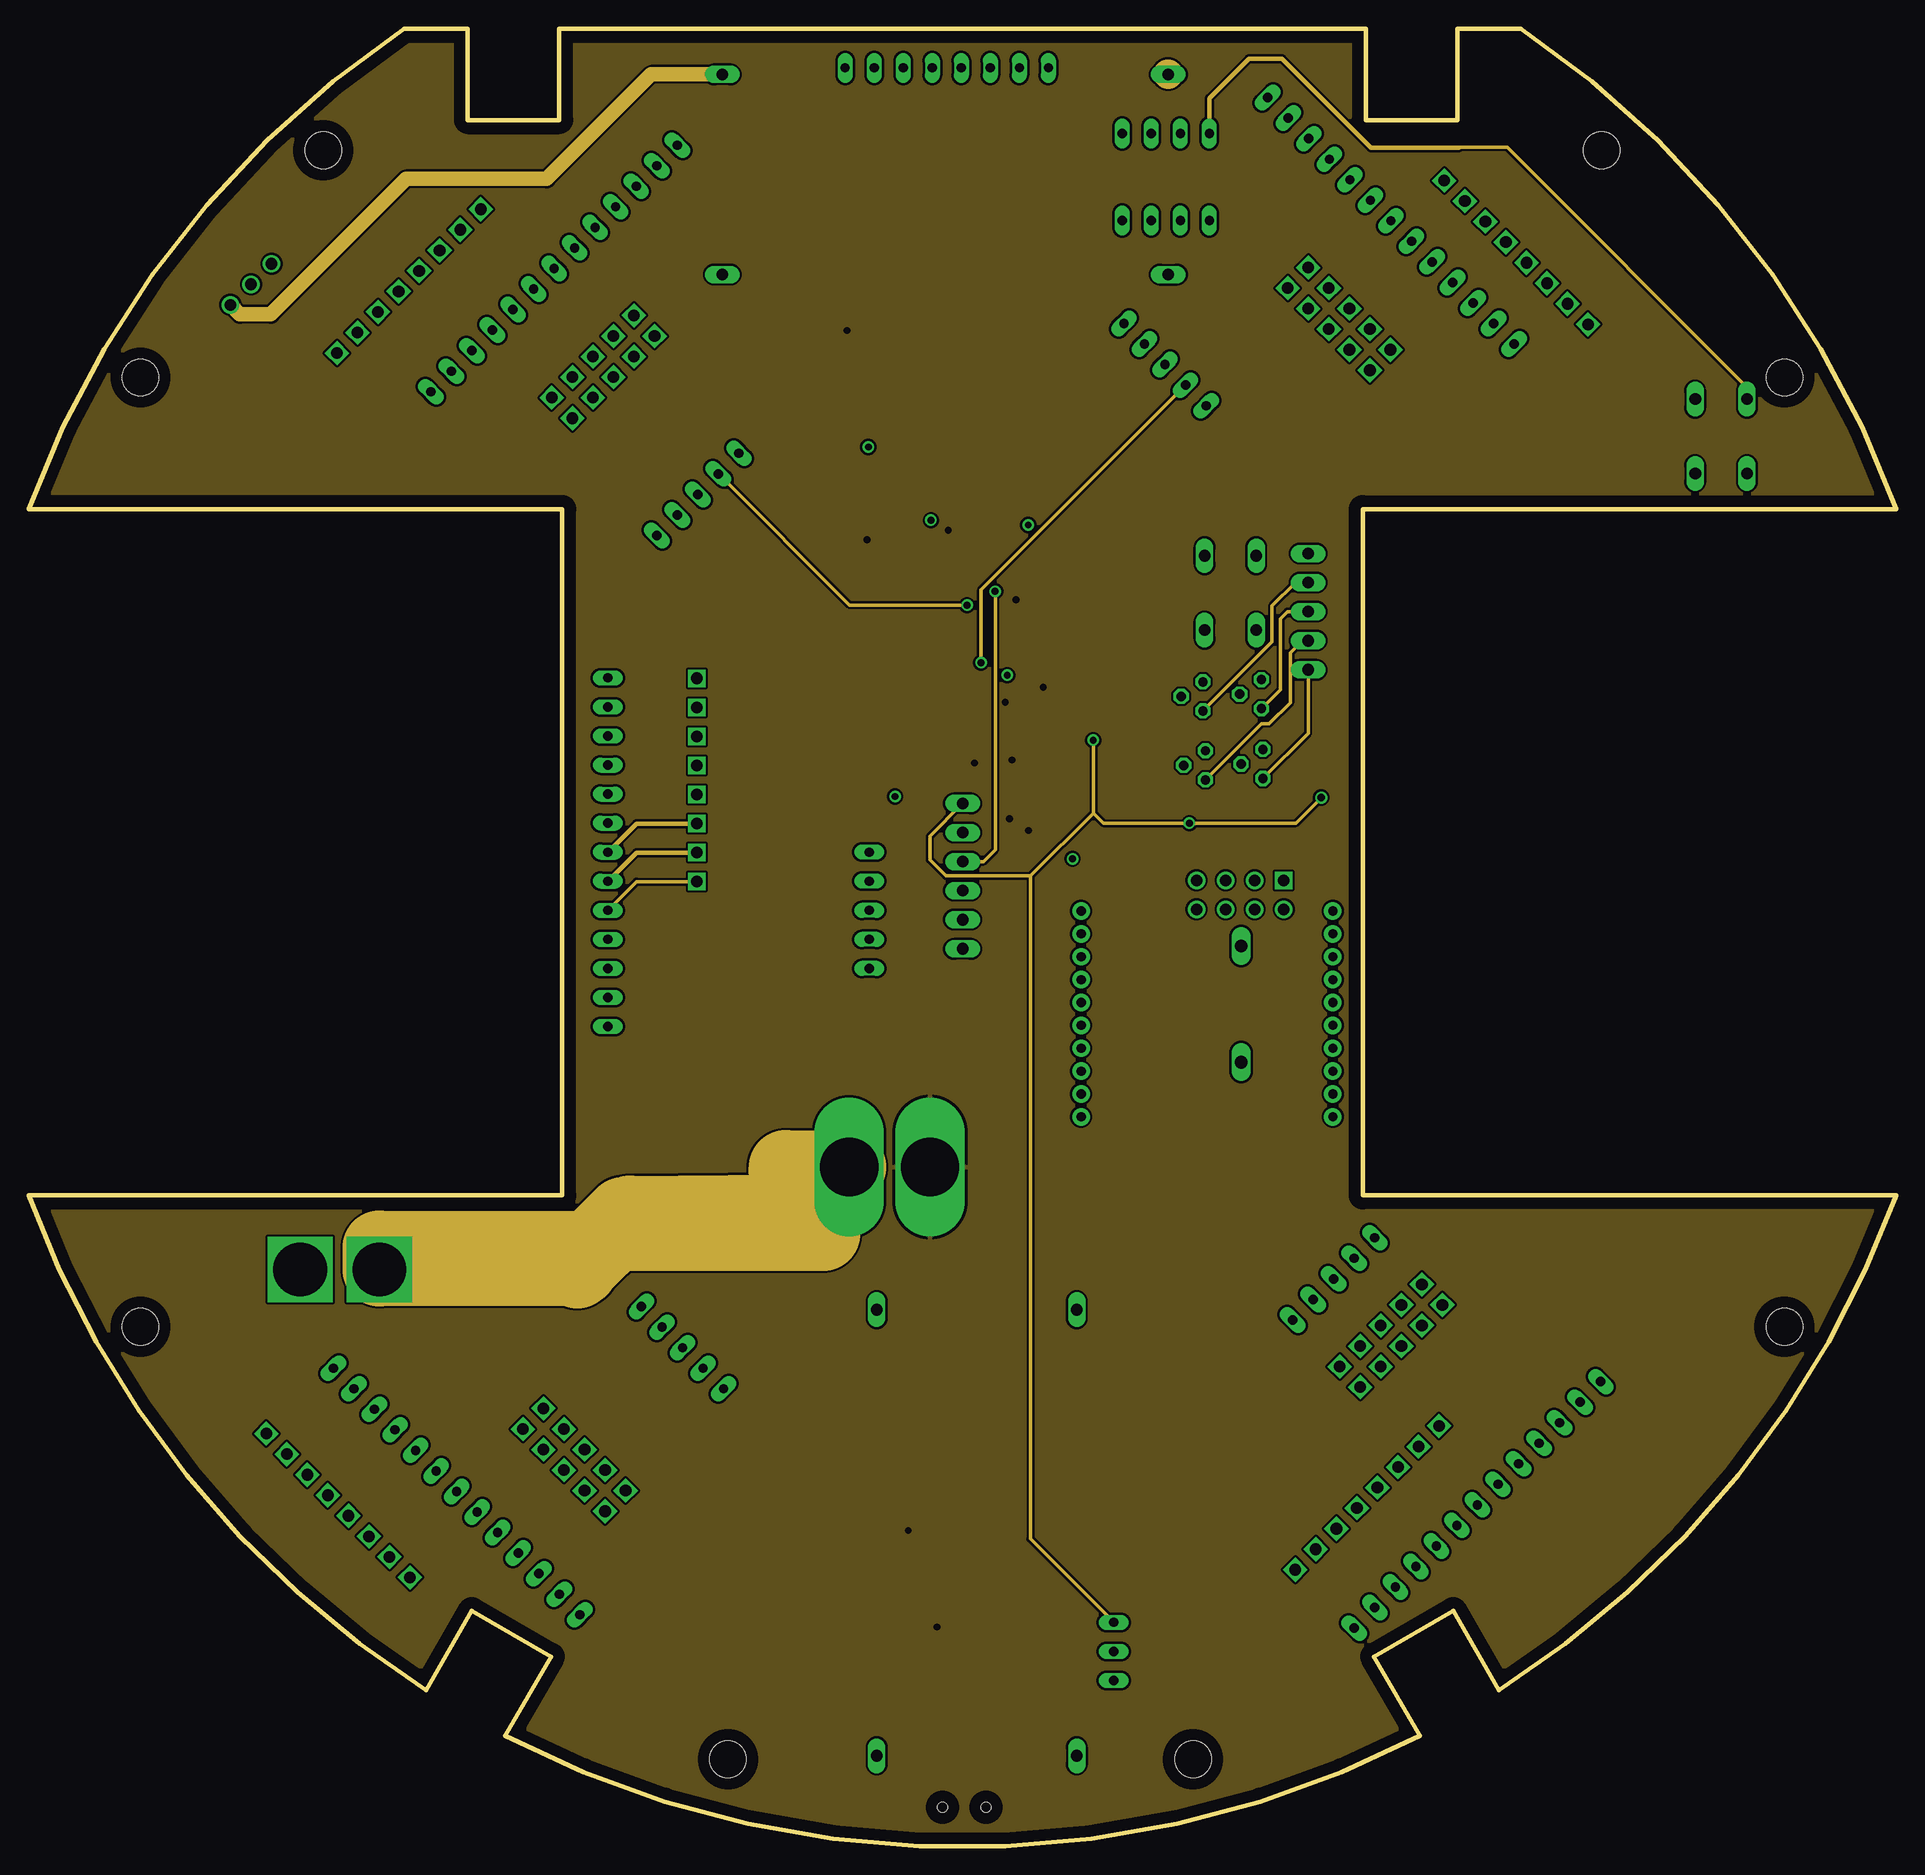
[diagram p4: board, inner layer Route15]
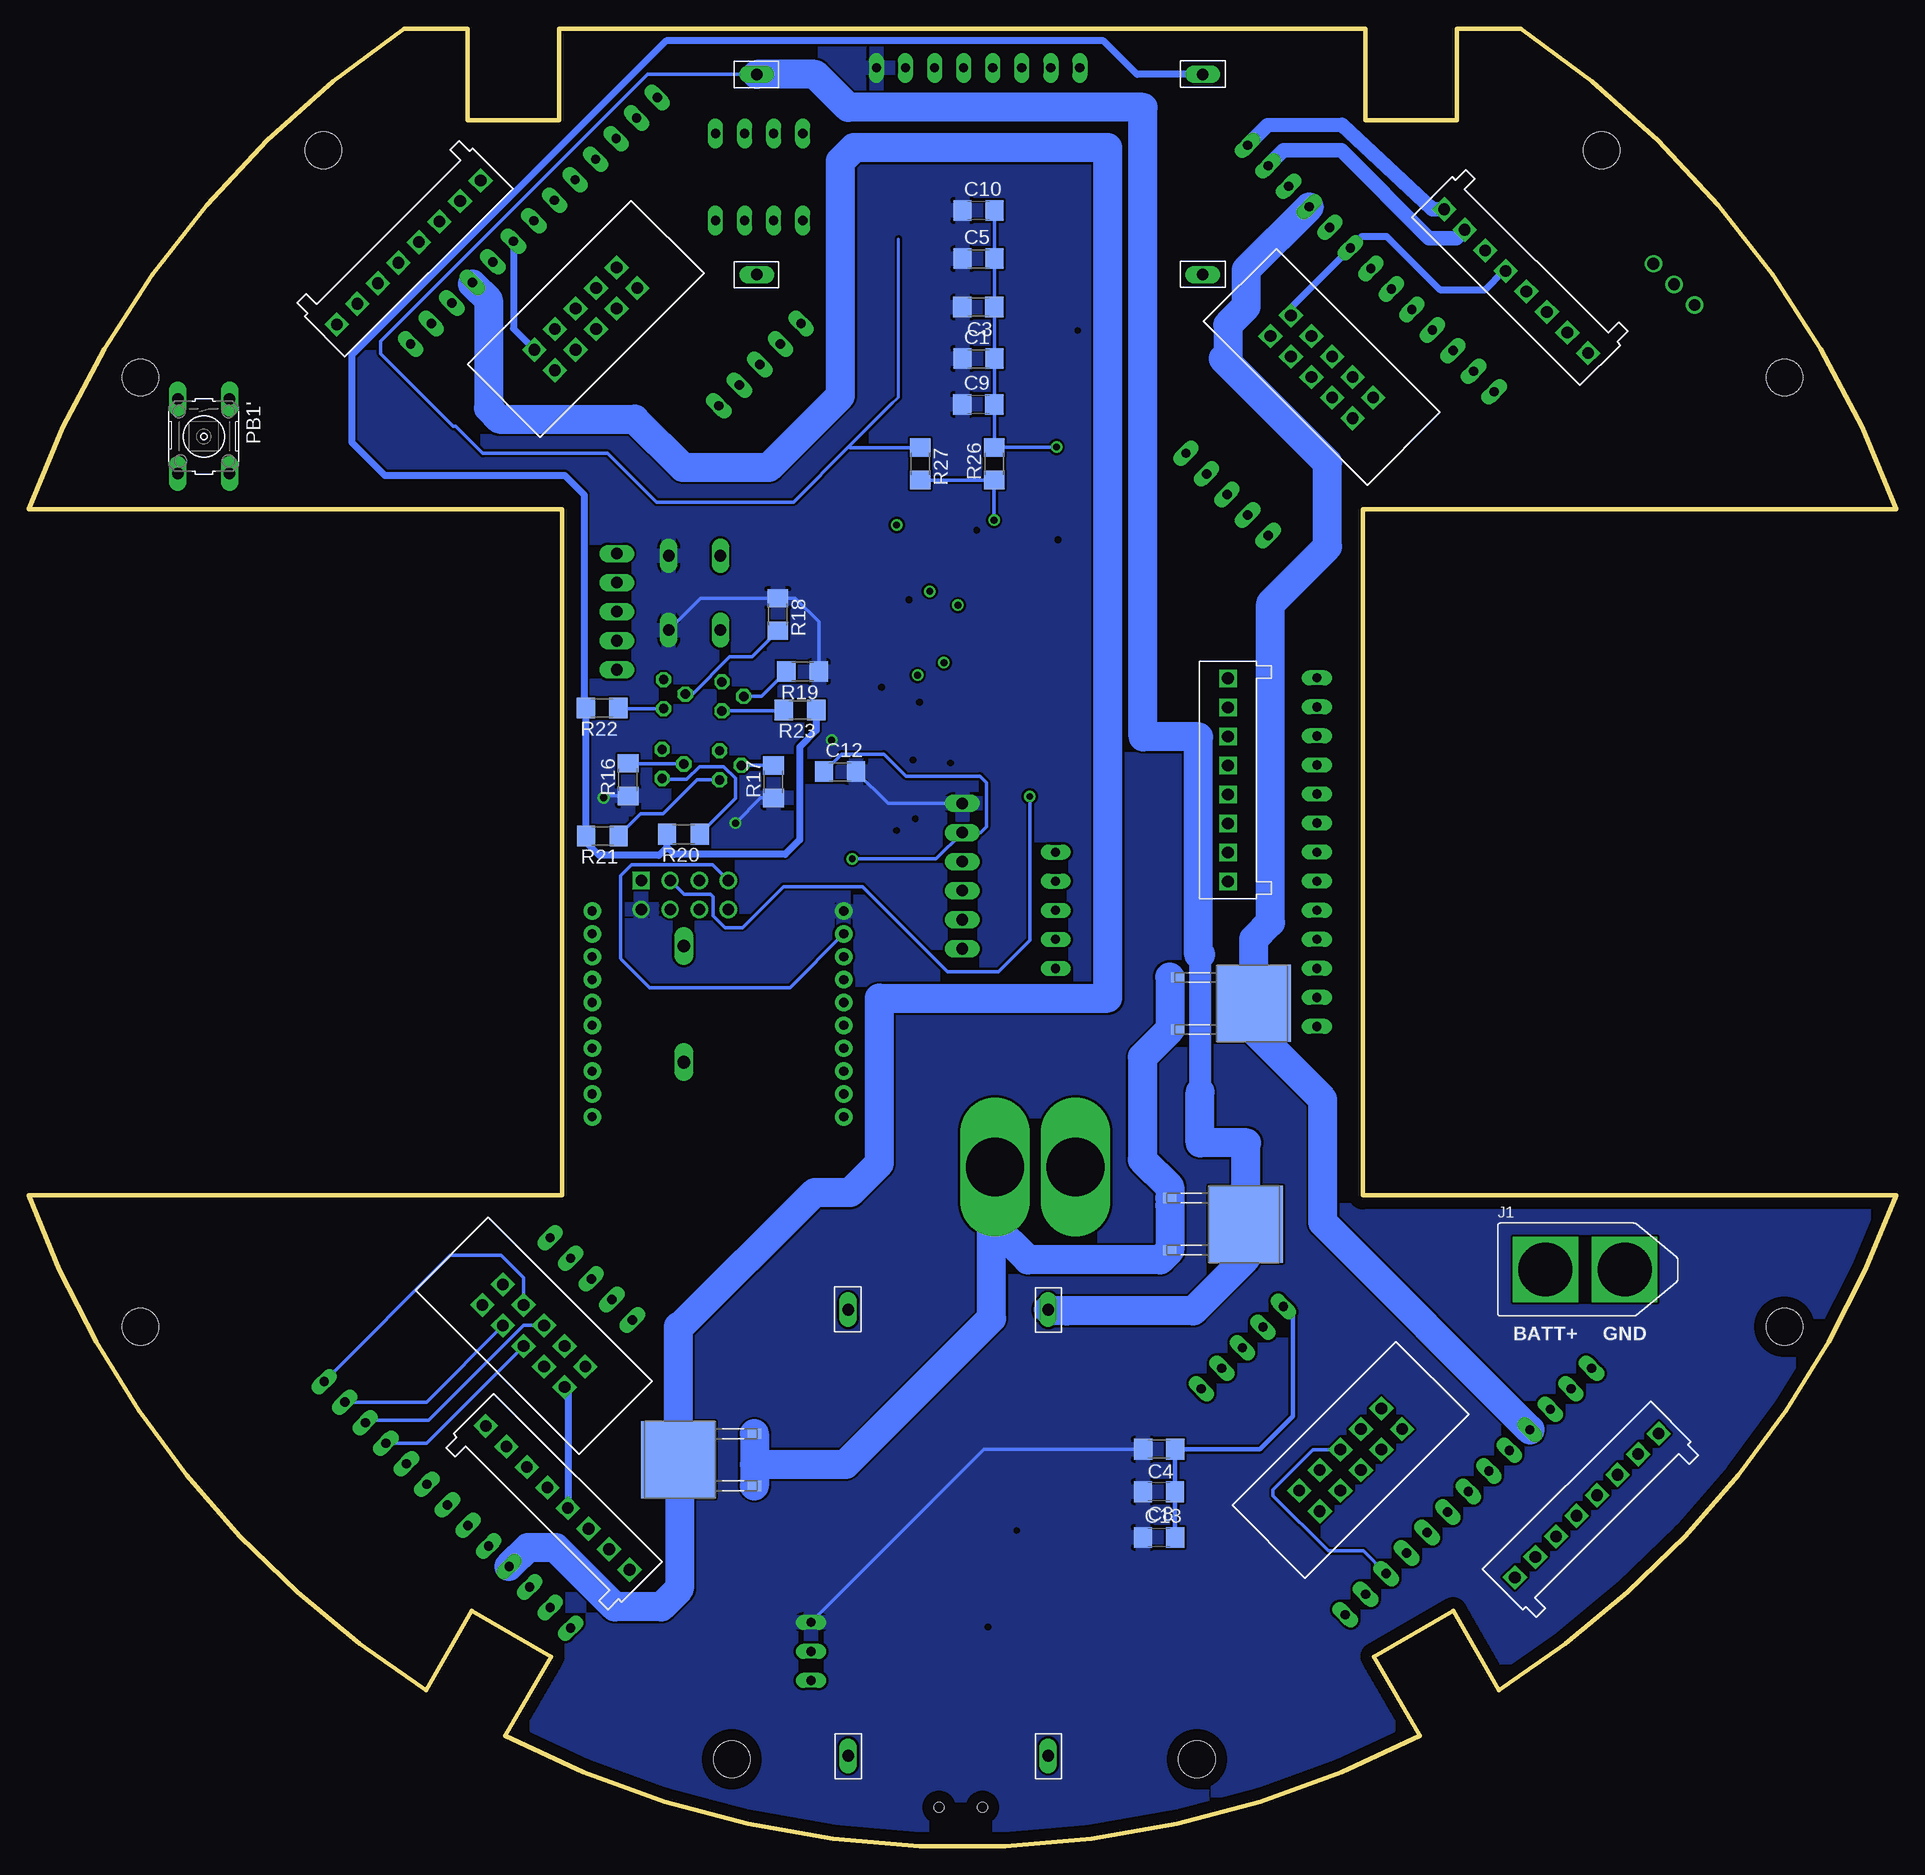
[diagram p5: board, bottom side, seen from below]

Size 163.33 x 158.91 mm. Coordinates in mm from the lower left corner, seen from the top.
Outline: 46.41,158.91 46.41,150.91 38.41,150.91 38.41,158.91 32.83,158.91 arc36 0,116.91 46.66,116.91 46.66,56.91 0,56.91 arc37 34.74,13.65 38.75,20.58 45.67,16.58 41.67,9.65 arc55 121.65,9.65 117.65,16.58 124.57,20.58 128.58,13.65 arc37 163.33,56.91 116.67,56.91 116.67,116.91 163.33,116.91 arc36 130.5,158.91 124.93,158.91 124.93,150.91 116.93,150.91 116.93,158.91 46.41,158.91
Outline: 46.41,158.91 46.41,158.91
Copper layers ((1*2)+(15*16)): Top 0.09mm / dielectric 0.2mm / Route2 0.07mm / dielectric 1.5mm / Route15 0.07mm / dielectric 0.2mm / Bottom 0.09mm
Design rules "default *": minimum track width 10mil, minimum drill 24mil, track to track 8mil, track to pad 8mil, pad to pad 8mil, via to via 8mil, smd to smd 8mil, copper to edge 40mil, drill to drill 8mil, minimum pad ring 10mil, minimum via ring 8mil, stop-mask expansion 4mil, vias tented up to drill 0mil, thermal gap 10mil
Holes 3.2 mm at 9.78,45.41 61.15,7.61 101.83,7.61 153.54,45.41 25.77,148.27 9.78,128.41 137.55,148.27 153.54,128.41

### Footprints (pad centres in the part's own frame; a part is rotated, then mirrored left to right if it is on the bottom)
PINHEAD_1 = drill 1.016 long: P$1 0,0
C1206 = smd 1.6 x 1.8: 1 -1.4,0; 2 1.4,0
SOD81 = drill 1.118 long: A 5.08,0; C -5.08,0
XT-60 = drill 4.7 square: BATT 0,4.154; GND 0,11.092
FRC = drill 1.016 square: P$1 -8.89,0; P$2 -6.35,0; P$3 -3.81,0; P$4 -1.27,0; P$5 1.27,0; P$6 3.81,0; P$7 6.35,0; P$8 8.89,0
FRC2*5 = drill 1.016 square: P$1 -5.08,1.27; P$2 -5.08,-1.27; P$3 -2.54,1.27; P$4 -2.54,-1.27; P$5 0,1.27; P$6 0,-1.27; P$7 2.54,1.27; P$8 2.54,-1.27; P$9 5.08,1.27; P$10 5.08,-1.27
1X03 = drill 1.016: 1 -2.54,0; 2 0,0; 3 2.54,0
CHIPLED_1206 = smd 1.5 x 1.5: A 0,-1.75; C 0,1.75
WIRELESS-NRF24L01 = drill 1 square: 1 -12.7,6.35 | drill 1: 2 -10.16,6.35; 3 -12.7,3.81; 4 -10.16,3.81; 5 -12.7,1.27; 6 -10.16,1.27; 7 -12.7,-1.27; 8 -10.16,-1.27
B3F-10XX = drill 1.016 long: 1 -3.251,2.261; 2 3.251,2.261; 3 -3.251,-2.261; 4 3.251,-2.261
TO-92 = drill 0.813 long: 1 -2.54,0; 2 0,0; 3 2.54,0
M0805 = smd 1.3 x 1.6: 1 -0.95,0; 2 0.95,0
R1206 = smd 1.6 x 1.803: 1 -1.422,0; 2 1.422,0
MA05-1 = drill 1.016 long: 1 -5.08,0; 2 -2.54,0; 3 0,0; 4 2.54,0; 5 5.08,0
FE08 = drill 0.813 long: 1 -8.89,0; 2 -6.35,0; 3 -3.81,0; 4 -1.27,0; 5 1.27,0; 6 3.81,0; 7 6.35,0; 8 8.89,0
FE13 = drill 0.813 long: 1 -15.24,0; 2 -12.7,0; 3 -10.16,0; 4 -7.62,0; 5 -5.08,0; 6 -2.54,0; 7 0,0; 8 2.54,0; 9 5.08,0; 10 7.62,0; 11 10.16,0; 12 12.7,0; 13 15.24,0
FE05-1 = drill 0.813 long: 1 -5.08,0; 2 -2.54,0; 3 0,0; 4 2.54,0; 5 5.08,0
MA06-1 = drill 1.016 long: 1 -6.35,0; 2 -3.81,0; 3 -1.27,0; 4 1.27,0; 5 3.81,0; 6 6.35,0
EDG-04 = drill 0.813 long: 1 -3.81,-3.81; 2 -1.27,-3.81; 3 1.27,-3.81; 4 3.81,-3.81; 5 3.81,3.81; 6 1.27,3.81; 7 -1.27,3.81; 8 -3.81,3.81
TO92 = drill 0.813 octagon: 1 1.27,0; 2 0,1.905; 3 -1.27,0
SOT223 = smd 1.219 x 2.235: 1 -2.311,-3.099; 2 0,-3.099; 3 2.311,-3.099 | smd 3.6 x 2.2: 4 0,3.099
TO228P1042X238-3N = smd 0.889 x 1.219: 1 -2.286,-6.502; 3 2.286,-6.502 | smd 6.731 x 6.502: 2 0,0.152
USB-AB-MICRO-SMD_V03 = smd 1.4 x 0.4: D+1 2.7,0; D-1 2.7,0.65; GND1 2.7,-1.3; ID1 2.7,-0.65; VBUS1 2.7,1.3 | smd 1.5 x 1.8: SHIELD1 0,3.68; SHIELD3 0,-3.68 | smd 1.5 x 2.5: SHIELD2 0,0 | hole 0.85: 2.2,1.9; 2.2,-1.9
LQFP100 = smd 1.5 x 0.35: 1 -8,6; 2 -8,5.5; 3 -8,5; 4 -8,4.5; 5 -8,4; 6 -8,3.5; 7 -8,3; 8 -8,2.5; 9 -8,2; 10 -8,1.5; 11 -8,1; 12 -8,0.5; 13 -8,0; 14 -8,-0.5; 15 -8,-1; 16 -8,-1.5; 17 -8,-2; 18 -8,-2.5; 19 -8,-3; 20 -8,-3.5; 21 -8,-4; 22 -8,-4.5; 23 -8,-5; 24 -8,-5.5; 25 -8,-6; 51 8,-6; 52 8,-5.5; 53 8,-5; 54 8,-4.5; 55 8,-4; 56 8,-3.5; 57 8,-3; 58 8,-2.5; 59 8,-2; 60 8,-1.5; 61 8,-1; 62 8,-0.5; 63 8,0; 64 8,0.5; 65 8,1; 66 8,1.5; 67 8,2; 68 8,2.5; 69 8,3; 70 8,3.5; 71 8,4; 72 8,4.5; 73 8,5; 74 8,5.5; 75 8,6 | smd 0.35 x 1.5: 26 -6,-8; 27 -5.5,-8; 28 -5,-8; 29 -4.5,-8; 30 -4,-8; 31 -3.5,-8; 32 -3,-8; 33 -2.5,-8; 34 -2,-8; 35 -1.5,-8; 36 -1,-8; 37 -0.5,-8; 38 0,-8; 39 0.5,-8; 40 1,-8; 41 1.5,-8; 42 2,-8; 43 2.5,-8; 44 3,-8; 45 3.5,-8; 46 4,-8; 47 4.5,-8; 48 5,-8; 49 5.5,-8; 50 6,-8; 76 6,8; 77 5.5,8; 78 5,8; 79 4.5,8; 80 4,8; 81 3.5,8; 82 3,8; 83 2.5,8; 84 2,8; 85 1.5,8; 86 1,8; 87 0.5,8; 88 0,8; 89 -0.5,8; 90 -1,8; 91 -1.5,8; 92 -2,8; 93 -2.5,8; 94 -3,8; 95 -3.5,8; 96 -4,8; 97 -4.5,8; 98 -5,8; 99 -5.5,8; 100 -6,8
XBEE-SILK = drill 0.8 pad 1.524: 1 -11,20; 2 -11,18; 3 -11,16; 4 -11,14; 5 -11,12; 6 -11,10; 7 -11,8; 8 -11,6; 9 -11,4; 10 -11,2; 11 11,2; 12 11,4; 13 11,6; 14 11,8; 15 11,10; 16 11,12; 17 11,14; 18 11,16; 19 11,18; 20 11,20
DA10 = drill 5.08 pad 5.334 long: P$1 0,0; P$2 -7.048,0

### Placement (x,y rotation side)
5V  60.66,154.91 270 bottom
12V  74.16,7.91 180 bottom
C1  80.27,130.07 0 bottom
C2  91.49,38.89 90 top
C3  80.28,134.57 180 bottom
C4  64.47,34.71 180 bottom
C5  80.26,138.8 0 bottom
C6  92.26,89.2 180 top
C7  68.23,95.89 90 top
C8  64.47,31 180 bottom
C9  80.28,126.06 0 bottom
C10  80.26,143.01 0 bottom
C11  69.92,89.57 270 top
C12  92.37,93.95 0 bottom
C13  64.47,27.01 0 bottom
C69  68.52,134.49 0 top
D3  106.03,73.64 270 top
GND  60.66,137.41 270 bottom
GND2  91.66,7.91 180 bottom
GND_5V  99.66,137.41 90 bottom
GND_12V  91.66,46.91 0 bottom
J1  34.84,50.43 270 bottom
JP1  130.08,139.34 45 bottom
JP2  27.07,29.79 225 bottom
JP3  47.72,33.79 225 bottom
JP4  114.6,133.53 45 bottom
JP5  33.25,136.83 315 bottom
JP6  50.25,129.34 315 bottom
JP7  117.05,30.46 135 bottom
JP8  119.15,44.63 135 bottom
JP9  58.44,93.22 270 bottom
JP11  19.45,136.56 45 top
LED1  100.62,18.89 90 top
LED8  133.93,122.49 0 top
LED9  130.13,123 0 top
LED_3.3V  19.12,121.62 180 top
LED_5V  22.37,121.53 180 top
LED_8V  29,121.47 180 top
LED_12V  32.5,121.35 180 top
M1  103.41,71.75 270 top
PB1'  148.01,123.27 270 bottom
PB1'1  105.1,109.58 90 top
Q1  94.9,17.04 270 top
R1  68.08,130.69 180 top
R4  83.83,12.44 270 top
R5  79.41,12.24 270 top
R8  89.11,14.18 0 top
R9  121.91,122.06 180 top
R10  115.05,122.12 180 top
R11  99.26,23.37 0 top
R12  89.45,19.19 0 top
R15  137.7,122.79 270 top
R16  110.91,93.26 90 bottom
R17  98.19,93.07 90 bottom
R18  97.81,107.69 270 bottom
R19  95.65,102.69 180 bottom
R20  106.06,88.48 180 bottom
R21  113.16,88.33 180 bottom
R22  113.18,99.5 180 bottom
R23  95.88,99.33 180 bottom
R24  38.46,123.11 180 top
R25  18.91,127.65 90 top
R26  78.9,120.87 90 bottom
R27  85.36,120.87 270 bottom
R28  22.34,127.78 90 top
R29  29.45,126.26 0 top
SV1  111.9,107.94 90 top
SV2  80.29,155.48 180 top
SV3  37.43,31.02 315 top
SV4  57.19,43.6 135 top
SV6  81.67,84.82 90 top
SV7  126.7,29.85 45 top
SV8  114.13,49.61 225 top
SV9  119.14,142.11 135 top
SV10  99.38,129.54 315 top
SV11  45.95,137.95 225 top
SV12  58.52,118.19 45 top
SV14  50.66,86.91 270 top
SV15  73.52,81.83 90 top
SW1  99.45,145.94 0 top
T1  107.94,94.63 90 top
T2  102.91,94.5 90 top
T3  107.81,100.73 90 top
T4  102.7,100.53 90 top
U1  87.67,26.48 0 top
U2  57.04,54.39 270 bottom
U3  56.34,73.69 270 bottom
U4  106.36,33.79 90 bottom
U5  81.81,5.6 270 top
U$1  85.91,105.48 270 top
U$2  103.04,61.77 0 top
U$3  78.82,59.38 0 top
V_BAT  99.66,154.91 90 bottom
V_BAT_12V  74.16,46.91 180 bottom

### Tracks (layer width: path | path; a pad name or v marks a point on that pad's centre or on a via)
3.3V  (via drill 0.6, 0.6 layers 15-16, 0.64)
  Top 0.254: 77.16,150.17 82.12,145.2 82.12,140.1 | 93.38,144.59 89.03,144.59 80.38,153.24 | 80.38,153.24 80.38,156.99 80.63,157.24 87.42,157.24 SV2.1 | 77.4,150.17 77.4,150.26 80.38,153.24
  Top 0.305: U$1.28 79.34,110.48 79.58,110.72 | U$1.22 U$1.21 81.89,113.46 81.89,111.88 | 81.89,111.88 82.4,111.88 | 82.4,111.88 82.91,111.88 U$1.19 | U$1.11 86.9,110.8 85.34,109.25 85.34,108.36 85.48,108.22 | U$1.6 89.44,113.46 89.44,111.7 | 89.44,111.7 89.44,110.83 86.83,108.22 85.48,108.22 | 85.48,108.22 84.5,108.22 82.4,110.32 82.4,111.88 | 79.58,110.72 80.75,111.88 81.89,111.88 | 90.84,111.7 89.44,111.7 | 79.58,110.72 79.83,110.47 79.83,100.39 78.93,99.48 U$1.50 70.51,99.48 69.92,98.88 C11.1 | 90.84,111.7 90.64,111.5 90.64,100.19 91.91,98.91 U$1.75 92.32,97.48 v93.1,96.7 | 93.38,144.59 108.08,144.59 121.17,131.51 121.17,130.46 116.66,125.96 110.67,125.96 103.82,119.11 96.66,119.11 92.76,115.21 92.76,111.48 U$1.100 93.7,111.7 90.84,111.7 | 82.12,140.6 82.12,140.1 82.12,135.16 82.18,135.11 77.76,130.69 R1.1 | 87.67,22.4 R12.2 91.26,19.58 Q1.1 | R25.2 18.91,130.46 15.7,133.66 15.7,136.57 23.89,144.75 45.83,144.75 51.49,150.41 76.91,150.41 77.16,150.17 77.4,150.17
  Top 0.406: U1.2 87.67,22.4
  Top 0.61: U1.4 U1.2
  Route2 0.305: v113.04,91.68 113.04,85.18 M1.2
  Route15 0.305: v93.1,96.7 93.1,90.33 | 93.1,90.33 87.61,84.84 87.6,84.84 | SV6.6 78.81,88.3 78.81,86.24 80.21,84.84 87.6,84.84 | v113.04,91.68 110.8,89.45 v101.51,89.45 93.98,89.45 93.1,90.33 | 87.6,84.84 87.6,26.88 Q1.1
  Bottom 0.305: R19.1 94.22,107.04 96.29,109.11 R18.1 104.58,109.11 PB1'1.3 | C12.2 88.19,91.17 SV6.6 | R16.1 112.88,91.84 v113.04,91.68 | R17.1 99.3,91.65 v101.51,89.45 | C4.2 79.77,34.71 Q1.1
  pour Bottom: -9.46,167.87 173.48,167.87 173.48,-2.64 -9.44,-2.64 -9.44,167.86
5V
  Top 0.305: C2.1 58.61,37.49 50.48,45.62 50.48,66.18 61.15,76.85 61.15,103.18 51.46,112.86 51.46,117.7 40.45,128.71 39.02,128.71 34.68,133.05 33.44,133.05 24.08,142.41 22.85,142.41 17.35,136.91 17.35,135.07 JP11.1 | R28.2 22.8,128.75
  Top 0.61: R11.1 U1.3 91.49,24.88 C2.1 | 17.65,134.73 JP11.1 17.65,133.89 R28.2
  Route15 1.27: 5V.P$1 54.45,154.91 45.32,145.78 33.01,145.78 21.17,133.94 18.48,133.94 JP11.1
  Bottom 0.305: 114.6,88.35 R21.2
  Bottom 0.61: R22.2 114.6,88.35 | 114.16,87.91 R21.2 114.58,87.78 113.43,86.63 108.21,86.63 107.49,87.35 | R23.1 94.45,97.55 95.9,96.11 95.9,87.99 97.16,86.72 106.86,86.72 107.49,87.35 | 114.75,99.65 114.75,118.16 116.45,119.85 132.18,119.85 135.06,122.74 135.06,130.34 107.56,157.83 69.31,157.83 66.39,154.91 5V.P$1 | 107.49,87.35 R20.2
  Bottom 1.27: R20.2 107.49,88.25 | 114.75,99.65 R22.2
5VM
  Top 0.61: JP1.P$4 126.45,138.45 123.88,141.02 121.64,141.02 SV9.6
  Bottom 0.61: SV9.6 120.93,132.68 JP4.P$1
5VM2
  Bottom 0.61: 34.32,137.73 35.95,136.1 39.93,136.1 44.59,140.75 46.73,140.75 SV11.6 47.75,139.72 52.94,134.53 JP6.P$1
  Bottom 1.27: 34.32,137.73 JP5.P$4
5VM3
  Top 0.61: JP2.P$4 28.3,32.82 SV3.6 39.3,36.48 JP3.P$1
5VM4
  Top 0.61: JP7.P$4 116.58,29.14 123.82,29.14 SV7.6
  Bottom 0.61: JP8.P$1 116.16,39.85 JP7.P$4
5VM5
  Top 0.61: SV14.6 55.7,94.49 JP9.P$4
12V
  Top 1.016: 48.44,96.3 48.5,118.1 43.06,123.1 R24.1 | 48.44,96.3 49.84,94.54 SV14.4 | 12V.P$1 56.58,25.5 56.58,36.26 48.44,44.4 48.44,96.3
  Top 1.27: SV14.4
A_1
  Route2 0.305: SV9.10 113.56,147.31 113.56,144.12 117.02,140.65 117.02,135.96 JP4.P$5
A_2
  Route2 0.305: JP6.P$5 49.35,130.25 47.78,131.82 41.28,131.82 41.28,131.84 SV11.10
A_3
  Top 0.305: JP3.P$5 46.82,29.64 SV3.10
A_4
  Bottom 0.305: JP8.P$5 128.54,35.24 SV7.10
ADC  (via drill 0.6 layers 1-2)
  Top 0.305: U$1.24 v80.42,115.06
  Route2 0.305: v80.42,115.06 77.64,115.06 73.9,111.32 54.2,111.32 47.16,118.37 35.45,118.37 19.45,134.36 | 19.45,134.36 | JP11.2 19.45,134.75 19.45,134.36
B_1
  Route2 0.305: SV9.12 110.15,143.51 114.43,139.24 114.43,136.96 JP4.P$7
B_2
  Route2 0.305: JP6.P$7 37.47,128.44 37.47,128.47 SV11.12
B_3
  Top 0.305: JP3.P$7 48.62,24.25 SV3.12
B_4
  Bottom 0.305: JP8.P$7 128.54,38.83 SV7.12
BAT_ADC  (via drill 0.6)
  Top 0.305: U$1.25 78.9,114.49 v78.9,115.94
  Bottom 0.305: R27.2 R26.1 v78.9,115.94
BATT_LEVEL
  Bottom 1.016: U3.1 62.87,76 63.56,76 | 63.52,71.41 U3.3
  Bottom 2.54: U4.3 99.86,33.39 | 99.86,33.39 U4.1 | 99.86,33.39 91.87,33.39 79.11,46.15 79.11,54.43 | 79.11,54.43 79.11,59.09 U$3.P$1 | 79.11,54.43 75.95,51.27 64.37,51.27 U2.3 63.54,56.02 U2.1 63.54,57.65 65.93,60.04 65.93,68.99 63.52,71.41 63.52,75.96 63.56,76
  pour Route15: -10.7,169.44 178.15,169.44 178.15,-4.87 -10.68,-4.87 -10.68,169.43
BATTERY
  Route15 6.452: J1.BATT 30.69,52.34 48.3,52.34 48.3,50.48 47.21,50.48 | 30.93,50.48 47.21,50.48 | 47.21,50.48 52.01,55.29 52.01,54.31 47.97,50.26 52.56,55.39 65.55,55.5 65.55,53.76 52.01,53.76 52.01,53.54 69.49,53.54 69.49,58.78 66.21,58.78 66.21,59.38 U$3.P$2
BOT_COLOR
  Top 0.305: SW1.1 99.07,138.7 103.09,138.7 108.02,133.77 108.02,127.64 102.45,122.07 95.69,122.07 90.41,116.79 U$1.4
CE  (via drill 0.6)
  Top 0.305: U$1.55 81.91,96.44 80.12,94.65 78.65,94.65 v75.78,91.78
  Bottom 0.305: v75.78,91.78 75.78,79.22 78.53,76.46 82.96,76.46 90.4,83.9 97.32,83.9 100.9,80.32 102.44,80.32 103.48,81.35 103.48,83.01 103.71,83.24 106.01,83.24 M1.3
CSN
  Top 0.305: U$1.88 99.12,105.48 101.56,103.05 108.85,103.05 111.67,100.23 111.67,88.63 108.64,85.6 108.64,83.33 M1.4
DIN1_1  (via drill 0.6)
  Top 0.305: v83.29,103.47 83.91,102.85 U$1.59
  Route15 0.305: v83.29,103.47 83.29,109.86 SV10.4
DIN1_2  (via drill 0.6)
  Top 0.305: U$1.60 84.41,106.16 v82.06,108.51
  Route15 0.305: v82.06,108.51 71.79,108.51 SV12.4
DIN1_3  (via drill 0.6 layers 1-2)
  Top 0.305: U$1.61 84.91,96.02 83.61,94.71 v82.71,94.71
  Route2 0.305: SV4.4 55.39,39.2 56.95,37.64 62.42,37.64 63.64,38.87 63.64,88.32 70.04,94.71 v82.71,94.71
DIN1_4  (via drill 0.6 layers 1-2)
  Top 0.305: U$1.62 v85.41,100.04
  Route2 0.305: v85.41,100.04 85.69,100.04 89.73,95.99 89.73,58.1 100.04,47.8 112.31,47.8 SV8.4 112.31,47.84
DIN1_5
  Top 0.305: U$1.47 68.15,100.98 66.29,99.12 66.29,86.57 68.48,84.38 SV15.4
DIN2_1
  Top 0.305: U$1.35 71,106.98 70.09,107.89 70.09,117.19 71.83,118.93 87.71,118.93 98.33,129.54 SV10.3 99.36,129.56
DIN2_2
  Top 0.305: U$1.38 70.15,105.48 | 70.15,105.48 70.02,105.48 | SV12.3 58.52,117.11 70.15,105.48
DIN2_3
  Top 0.305: U$1.40 66.84,104.48 62.27,99.91 62.27,48.74 57.19,43.66 SV4.3 57.19,43.62
DIN2_4
  Top 0.305: U$1.42 67.52,103.48 63.69,99.65 63.69,52.4 72.87,43.22 111.93,43.22 116.22,47.51 116.22,47.52 SV8.3
DIN2_5
  Top 0.305: SV15.3 74.52,81.83 75.8,80.56 75.8,78.65 75.06,77.92 71.98,77.92 67.7,77.92 65.09,80.53 65.09,99.51 68.06,102.48 U$1.44
DIN3_1
  Top 0.305: U$1.36 70.52,106.48 69.33,107.68 69.33,117.41 71.49,119.58 87.51,119.58 97.58,129.65 SV10.2
DIN3_2
  Top 0.305: U$1.39 66.93,104.98 56.73,115.18 SV12.2
DIN3_3
  Top 0.305: U$1.41 67.1,103.98 62.9,99.78 62.9,45.75 58.98,41.83 SV4.2
DIN3_4
  Top 0.305: U$1.43 67.78,102.98 64.46,99.67 64.46,52.6 73.05,44.01 105.95,44.01 109.63,47.68 110.57,47.68 112.53,45.72 113.22,45.72 114.2,46.7 114.2,47.85 111.51,50.55 111.51,52.09 112.75,53.32 114,53.32 SV8.2
DIN3_5
  Top 0.305: U$1.45 68.32,101.98 65.7,99.36 65.7,81.48 67.88,79.3 SV15.2
DIN4_1
  Top 0.305: U$1.34 71.38,107.48 70.82,108.05 70.82,116.83 72.24,118.25 88.03,118.25 97.49,127.71 99.4,127.71 101.49,129.8 101.49,130.59 97.98,134.1 96.76,134.1 SV10.1
DIN4_2  (via drill 0.6)
  Top 0.305: U$1.63 85.91,98.91 86.41,99.41 86.41,101.55 v85.58,102.39
  Route2 0.305: v85.58,102.39 85.58,104.23 83.51,106.29 83.51,114.85 80.93,117.43 78.38,117.43 73.52,112.57 56.95,112.57 SV12.1
DIN4_3  (via drill 0.6 layers 1-2)
  Top 0.305: U$1.64 86.41,95.39 v85.99,94.97
  Route2 0.305: SV4.1 60.78,86.57 69.95,95.74 69.95,95.73 83.29,95.73 84.05,94.97 v85.99,94.97
DIN4_4  (via drill 0.6 layers 1-2)
  Top 0.305: U$1.65 86.92,97.49 86.92,100.21 88.06,101.35 v88.73,101.35
  Route2 0.305: v88.73,101.35 88.76,101.37 93.73,101.37 97.48,97.62 111.79,97.62 115.43,93.98 115.43,81.2 115.4,81.18 115.4,55.51 SV8.1
DIN4_5
  Top 0.305: SV15.1 76.24,76.76 77.35,77.87 77.35,91.57 79.62,93.84 86.97,93.84 87.41,94.28 U$1.66
GND  (via drill 0.6)
  Top 0.305: U$1.74 91.38,97.45 91.43,97.39 91.43,92.01 | 81.64,116.49 82.41,115.72 U$1.20 82.41,114.18 | 81.64,116.49 81.16,116.97 76.93,116.97 75.62,115.66 75.62,111.9 76.53,110.99 U$1.27 | 91.43,92.01 91.43,91.99 93.66,89.76 C6.1 | JP11.3 24.04,135.56 24.04,128.88 | 24.04,128.88 24.04,120.56 23.26,119.78 LED_5V.C | 24.04,128.88 24.15,128.98 31.38,128.98 33.06,127.3 33.06,125 32.79,124.74 31.85,124.74 30.96,123.85 30.96,121.69 LED_8V.C | 102.94,125.91 SV10.5 96.53,125.95 88.14,117.56 82.7,117.56 81.64,116.49 | U$1.10 87.41,114.68 v87.41,115.51 | LED9.C 129.91,124.98 110.59,124.98 104.03,118.41 97.28,118.41 95.89,117.02 95.89,111.34 95.53,110.98 U$1.99 | 91.43,92.01 93.82,89.62 93.82,88.86 v91.3,86.33 | C69.2 66.99,137.41 GND.P$1 | v73.43,122.33 62.67,122.33 SV12.5
  Top 0.406: U5.SHIELD2 80.51,5.6 U5.GND1 | SV9.5 122.73,132.16 LED9.C 133.41,124.75 LED8.C 137.67,124.24 R15.1
  Route2 0.305: v87.41,115.51 SV10.5
  Route15 0.305: PB1'.3 150.27,127.56 129.31,148.52 125.08,148.52
  Route15 0.406: 125.08,148.52 117.37,148.52 109.59,156.3 106.72,156.3 103.24,152.82 103.24,149.77 SW1.5
  Bottom 0.305: C12.1 92.24,95.49 88.52,95.49 86.59,93.55 80.12,93.55 79.57,93 79.57,89.13 80.07,88.63 SV6.5 83.97,86.33 v91.3,86.33 | 78.87,122.31 C9.2 C1.2 C3.1 78.86,134.58 C5.2 C10.2 | 78.87,122.31 R26.2 | 78.87,122.31 73.43,122.31 v73.43,122.33
  Bottom 0.406: C13.2 C8.1 C4.1 55.67,34.71 52.77,37.61 52.77,46.36 SV4.5
  pour Top: -9.17,168.43 173.54,168.43 173.54,-2.64 -9.2,-2.64 -9.2,168.44
  pour Route2: -9.97,171.24 176.46,171.24 176.46,-3.79 -11.74,-3.79 -11.74,171.11 -9.85,171.11 -9.85,171.21
H1_1
  Route2 0.305: JP1.P$6 127.32,142.11 SV9.7
H1_2
  Route2 0.305: JP5.P$6 33.5,134.14 39.42,140.07 43.83,140.07 SV11.7
H1_3
  Top 0.305: SV3.7 33.69,31.02 JP2.P$6
H1_4
  Top 0.305: JP7.P$6 123.39,33.16 SV7.7
H1_5
  Route15 0.406: SV14.7 53.16,89.41 JP9.P$6
H2_1
  Route2 0.305: JP1.P$7 125.52,143.91 SV9.8
H2_2
  Route2 0.305: JP5.P$7 33.15,132.34 39.13,138.32 41.99,138.32 SV11.8
H2_3
  Top 0.305: JP2.P$7 35.49,29.23 SV3.8
H2_4
  Top 0.305: JP7.P$7 125.19,34.95 SV7.8
H2_5
  Route15 0.406: SV14.8 53.16,86.87 JP9.P$7
H3_1
  Route2 0.305: JP1.P$8 123.72,145.7 SV9.9
H3_2
  Route2 0.305: JP5.P$8 32.69,130.55 38.5,136.36 40.35,136.36 SV11.9
H3_3
  Top 0.305: JP2.P$8 37.28,27.43 SV3.9
H3_4
  Top 0.305: JP7.P$8 126.99,36.75 SV7.9
H3_5
  Route15 0.305: SV14.9 53.16,84.33 JP9.P$8
ID_0
  Top 0.305: U$1.3 90.91,116.09 95.97,121.16 102.88,121.16 108.73,127 108.73,133.83 103.16,139.4 100.91,139.4 SW1.2
ID_1
  Top 0.305: U$1.2 91.41,115.65 96.1,120.34 103.05,120.34 109.34,126.63 109.34,134.36 103.43,140.28 102.57,140.28 SW1.3
ID_2
  Top 0.305: SW1.4 103.26,141.45 109.97,134.74 109.97,126.26 103.44,119.74 96.39,119.74 91.91,115.26 U$1.1
INT  (via drill 0.6 layers 1-2)
  Top 0.305: U$1.33 72.45,107.98 72.2,108.24 72.2,113.12 v73.32,114.24
  Route2 0.254: SV2.8 69.5,153.58 69.5,122.9 73.32,119.09 v73.32,114.24
  Route2 0.305: v73.32,114.24 73.5,114.24
IRQ  (via drill 0.6 layers 1-2)
  Top 0.305: U$1.7 88.91,111.55 v86.33,108.97
  Route2 0.305: M1.8 90.38,93.67 90.38,98.7 89.8,98.7 87.36,101.13 87.36,101.71 | v86.33,108.97 87.37,107.94 87.36,107.93 87.36,101.71 | 87.36,101.71
KICKER_1
  Top 0.305: U$1.81 96.66,101.98 101.49,97.15 101.49,95.52 102.52,94.49 103.8,94.49 105.21,95.9 T1.1
KICKER_2
  Top 0.305: U$1.82 97.06,102.48 102.91,96.63 T2.1
KICKER_3
  Top 0.305: U$1.83 99.38,102.98 100.43,101.94 100.88,101.94 102.23,100.59 103.55,100.59 104.96,102 T3.1
KICKER_4
  Top 0.305: U$1.84 100.17,103.48 101.07,102.58 T4.1
M1_1
  Top 1.27: SV9.1 131.04,132.46 135.77,132.46 JP1.P$1
M1_2
  Bottom 1.27: JP5.P$1 40.57,143.12 48.48,150.51 54.96,150.47 54.98,150.47 SV11.1
M1_3
  Top 1.27: JP2.P$1 26.51,41.8 SV3.1
M1_4
  Top 1.27: JP7.P$1 115.87,19.08 SV7.1
M1_5
  Top 1.27: SV14.1 50.7,102.11 JP9.P$1
M2_1
  Top 1.27: SV9.2 129.37,134.38 134.1,134.38 JP1.P$2
M2_2
  Bottom 1.27: JP5.P$2 38.48,140.59 40.86,140.59 48.54,148.27 53.59,148.27 SV11.2
M2_3
  Top 1.27: JP2.P$2 28.3,40 SV3.2
M2_4
  Top 1.27: JP7.P$2 117.66,20.87 SV7.2
M2_5
  Top 1.27: SV14.2 50.7,99.57 JP9.P$2
M3_1
  Top 1.27: SV9.3 127.7,136.3 132.43,136.3 JP1.P$3
M3_2
  Top 1.27: JP5.P$3 38.19,137.28 39.94,137.28 49.21,146.56 51.7,146.56 SV11.3
M3_3
  Top 1.27: JP2.P$3 30.1,38.21 SV3.3
M3_4
  Top 1.27: JP7.P$3 119.46,22.67 SV7.3
M3_5
  Top 1.27: SV14.3 50.7,97.03 JP9.P$3
MISO
  Top 0.305: U$1.79 94.91,100.98 98.8,97.1 98.8,87.79 M1.7
  Bottom 0.305: U$2.2 96.74,75.07 109,75.07 111.46,77.53 111.57,77.64 111.57,84.87 110.61,85.83 103.53,85.83 M1.7
MOSI
  Top 0.305: U$1.80 95.22,101.48 99.43,97.27 99.43,89.62 103.4,85.64 103.4,83.16 104.66,81.91 M1.6
N$1
  Top 0.254: R5.2 83.62,6.7 83.62,4.56 83.35,4.45 81.83,4.45 81.81,4.43 U5.D+1
N$2
  Top 0.305: 130.12,121.24 LED9.A 127.03,124.37 118.72,124.37 R10.1
N$3
  Top 0.305: U$1.49 68.46,99.98 68.23,99.75 C7.2 | C7.2
N$4
  Top 0.305: U$1.73 90.9,89.24 C6.2
N$5
  Top 0.254: R4.2 84.15,10.82 84.15,4.17 83.85,4 82.46,4 82.46,3.99 U5.D-1
N$6
  Top 0.305: U$1.94 100.68,108.48 PB1'1.1 PB1'1.2 109,118.99 136.7,118.99 137.7,119.99 R15.2
N$9
  Top 0.305: LED8.A 132.86,119.67 125.72,119.67 R9.1
N$10
  Top 0.305: Q1.2 93.39,17.04 R8.2 90.53,16.7 R12.1
N$11
  Top 0.305: LED1.C 98.87,16.6 96.71,14.45 94.95,14.45
  Top 0.406: 94.95,14.45 Q1.3
N$12
  Top 0.305: D3.A 96.82,77.77 U$2.3
N$13
  Top 0.305: R11.2 102.37,21.69 LED1.A
N$14
  Top 1.016: LED_12V.A | LED_12V.A R24.2
N$15
  Top 0.305: R29.1 28.02,124.19 LED_8V.A
N$18
  Top 0.61: R28.1 22.37,126.34 LED_5V.A
N$19
  Top 0.305: R25.1 19.12,126.01 LED_3.3V.A
N$21
  Bottom 0.305: T3.2 105.28,100.73 102.02,103.99 100.08,103.99 R18.2
N$23
  Bottom 0.305: T1.2 110.85,94.63 R16.2
N$25
  Bottom 0.305: T2.2 98.19,94.5 R17.2
N$26
  Bottom 0.305: T4.2 99.23,100.53 R19.2
N$31
  Route15 0.305: T1.3 111.9,97.32 SV1.1
  Bottom 0.305: R20.1 101.51,91.62 101.51,93.36 102.53,94.39 104.67,94.39 105.78,93.28 107.86,93.28 T1.3
N$32
  Route15 0.305: T2.3 107.83,98.15 108.48,98.15 110.33,100 110.33,104.35 111.37,105.4 SV1.2
  Bottom 0.305: T2.3 104.89,93.23 107.86,90.27 109.8,90.27 R21.1
N$33
  Route15 0.305: T3.3 109.46,101.11 109.46,107.33 110.07,107.94 SV1.3
  Bottom 0.305: T3.3 111.71,99.46 R22.1
N$34
  Route15 0.305: T4.3 108.74,105.3 108.74,108.46 110.76,110.48 SV1.4
  Bottom 0.305: T4.3 97.36,99.26 R23.2
NRST  (via drill 0.6, 0.6 layers 1-2)
  Top 0.254: R1.2 67.12,129.36 67.99,128.49 86.02,128.49 92.79,135.27
  Top 0.305: C69.1 67.12,132.3 | 67.12,132.3 R1.2 | 92.79,135.27 103.82,135.27 107.19,131.9 107.19,127.78 102.19,122.79 100.89,122.79 98.6,125.08 97.8,125.08 97.79,125.09 96.5,125.09 88.18,116.77 85.78,116.77 85.41,116.4 U$1.14 85.41,110.61 v84.52,109.72 | PB1'.2 PB1'.1 | v71.58,132.52 67.34,132.52 67.12,132.3
  Route2 0.305: PB1'.2 145.75,127.28 124.25,148.78 115.31,148.78 108.14,155.95 104.74,155.95 101.22,152.43 80.69,152.43 73.28,145.02 73.28,134.23 v71.58,132.52
  Route15 0.305: SV6.4 83.49,86.09 84.54,87.14 84.54,109.7 v84.52,109.72
PA9
  Top 0.254: R8.1 87.68,4.45 86.14,2.9 U5.VBUS1
  Top 0.305: U$1.68 88.41,94.33 87.33,93.25 79.95,93.25 77.97,91.26 77.97,77.63 75.45,75.1 68.71,75.1 65.2,71.59 65.2,52.83 68.52,49.52 81.74,49.52 87.43,55.2 113.76,55.2 113.8,55.1 123.3,45.9 123.3,44.44 106.41,27.55 106.41,20.04 97.38,11.01 90.85,11.01 R8.1
PA10
  Top 0.305: U$1.69 88.91,93.96 87.43,92.48 80.13,92.48 78.67,91.02 78.67,77.35 75.83,74.51 69.04,74.51 66.15,71.61 66.15,53.03 68.93,50.24 81.46,50.24 87.08,55.86 117.61,55.86 125.61,47.79 125.61,44.87 107.62,26.88 107.62,19.71 90.24,2.33 | 90.24,2.33 | U5.ID1 81.16,1.68 89.49,1.68 arc45 89.67,1.76 90.24,2.33
PE0
  Top 0.305: U$1.97 96.28,109.98 97.33,111.03 97.33,116.33 98.09,117.09 104.66,117.09 107.4,119.83 118.26,119.83 R9.2
PE1
  Top 0.305: U$1.98 95.97,110.48 96.67,111.19 96.67,116.72 97.67,117.71 104.26,117.71 104.26,117.72 108.65,122.1 113.61,122.1 R10.2
SCK
  Top 0.305: U$1.78 94.62,100.48 98.14,96.96 98.14,81.17 100.6,78.72 D3.C 106.03,83.09 M1.5
SCL
  Top 0.254: 92.91,146.95 92.64,146.95 SV2.3
  Top 0.305: U$1.92 98.15,107.48 102.06,103.56 103.62,103.56 104.89,104.84 104.89,112.74 109.91,117.75 109.97,117.69 138.86,117.69 142.12,120.95 142.12,132.77 125.68,149.21 117.13,149.21 109.89,156.45 107.59,156.45 104.46,153.32 104.46,147.43 103.98,146.95 92.91,146.95
SDA
  Top 0.254: 93.14,145.94 91.11,145.94 SV2.4
  Top 0.305: U$1.93 98.47,107.98 102.37,104.08 103.38,104.08 103.76,104.46 104.31,105.02 104.31,113.3 | 104.31,113.3 | 104.31,113.3 109.36,118.35 138.61,118.35 141.46,121.2 141.46,132.42 139.43,134.45 139.42,134.45 125.41,148.46 116.7,148.46 109.79,155.37 107.75,155.37 105.35,152.97 105.35,147.3 103.99,145.94 93.14,145.94
SWCLK
  Top 0.305: U$1.76 96.23,97.16 96.23,87.99 89.24,80.99 84.9,80.99 84.88,81.01 SV6.2
SWDIO
  Top 0.305: SV6.1 79.46,80.68 79.46,84.26 80.02,84.82 86.28,84.82 88.54,87.08 88.54,90.85 90.41,92.72 U$1.72
TRACESWO
  Top 0.305: SV6.3 90.51,83.55 95.56,88.61 95.56,96.07 91.78,99.86 91.78,105.36 92.4,105.98 U$1.89
USB_DM  (via drill 0.6 layers 1-2)
  Top 0.305: U$1.70 89.41,93.47 v85.79,89.84 | v76.92,27.61 76.92,23.97 83.83,17.06 R4.1
  Route2 0.305: v76.92,27.61 76.83,27.7 76.83,49.15 75.84,50.14 67.12,50.14 65.1,52.16 65.1,71.62 69.17,75.69 82.09,75.69 85.79,79.39 v85.79,89.84
USB_DP  (via drill 0.6 layers 1-2)
  Top 0.305: U$1.71 89.91,93.09 87.43,90.6 v87.43,88.81 | v79.43,19.17 79.43,13.68 R5.1
  Route2 0.305: v87.43,88.81 87.43,79.9 82.57,75.04 69.67,75.04 65.98,71.35 65.98,52.57 67.66,50.89 77.61,50.89 79.3,49.2 79.3,19.3 v79.43,19.17
V_BAT
  Top 0.254: 50.65,151.08 57.43,157.86 98.17,157.86 99.66,156.37 V_BAT.P$1
  Top 0.305: 50.65,151.08 45.25,145.59 22.72,145.59 14.36,137.32 14.36,121.71 18.23,118.2 23.76,118.2 24.94,119.19 24.94,127.27 25.47,127.81 29.32,127.81 R29.2
  Route15 2.54: 99.64,154.94 V_BAT.P$1 99.62,154.95
  Bottom 0.254: 88,125.98 87.27,126.7 87.27,140.52
  Bottom 0.305: 87.81,126.16 88,125.98 91.59,122.39 | 91.59,122.39 96.45,117.52 108.42,117.52 112.68,121.78 123.6,121.78 125.96,124.14 126.18,124.14 132.52,130.48 132.52,131.58 109.19,154.91 V_BAT.P$1 | R27.1 91.49,122.29 91.59,122.39
  Bottom 1.93: 60.89,65.94 60.84,65.94 60.84,77.95
  Bottom 2.54: V_BAT_12V.P$1 74.07,46.82 72.57,46.82 72.55,46.81 61.48,46.81 56.9,51.38 56.9,54.37 U2.2 56.88,61.41 56.79,61.5 60.89,61.5 60.89,65.94 | 60.84,77.95 61.02,77.95 61.02,96.99 65.86,96.99 65.86,152.02 91.65,152.02 94.54,154.91 V_BAT.P$1
VDC_1
  Bottom 0.61: 124.52,136.61 SV9.4
  Bottom 2.54: SV7.4 119.67,26.11 117.23,26.11 112.06,20.94 108,20.94 106.41,22.53 106.41,33.69 U4.2 106.51,45.24 | 124.52,136.61 123.11,135.2 123.11,125.72 122.16,124.77 110.32,124.77 106.11,120.56 98.58,120.56 92.33,126.81 92.33,147.32 91.15,148.5 68.96,148.5 68.96,74.14 88.95,74.14 88.95,59.69 91.48,57.16 94.59,57.16 106.51,45.24 | 106.51,45.44 106.51,45.24
VDC_2
  Bottom 2.54: 58.45,129.67 49.75,120.96 49.75,113.63 54.73,108.64 54.73,80.77 56.19,79.31 U3.2 56.19,71.35 50.15,65.31 50.15,54.54 32.04,36.44 SV3.4 | 58.45,129.67 58.87,130.09 | 58.45,129.67 58.45,133.01 56.86,134.6 56.86,137.8 51.34,143.31 SV11.4
~A_1
  Route2 0.305: SV9.11 111.96,144.14 115.52,140.58 115.52,136.3 113.7,134.48 JP4.P$6
~A_2
  Route2 0.305: JP6.P$6 49.3,128.44 47.7,130.05 39.46,130.05 39.46,130.07 SV11.11
~A_3
  Bottom 0.305: JP3.P$6 51,34.69 54.49,31.19 54.49,30.66 49.66,25.83 46.6,25.83 SV3.11
~A_4
  Bottom 0.305: JP8.P$6 120.05,45.53 128.34,37.24 133.68,37.24 SV7.11
~B_1
  Route2 0.305: SV9.13 107.41,151.94 107.41,134.5 108.77,133.14 110.61,133.14 JP4.P$8 | JP4.P$8
~B_2
  Route2 0.305: 40.33,121.99 40.67,121.99 | 40.67,121.99 47.47,121.99 49.35,123.87 JP6.P$8 | SV11.13 35.49,127.17 40.67,121.99
~B_3
  Top 0.305: JP3.P$8 52.64,32.89 54.95,30.59 54.95,26.99 SV3.13
~B_4
  Bottom 0.305: JP8.P$8 120.04,49.71 121.99,51.65 126.45,51.65 SV7.13